# EAGLE schematic PFCEDU_V1 (EAGLE 8.6.1)
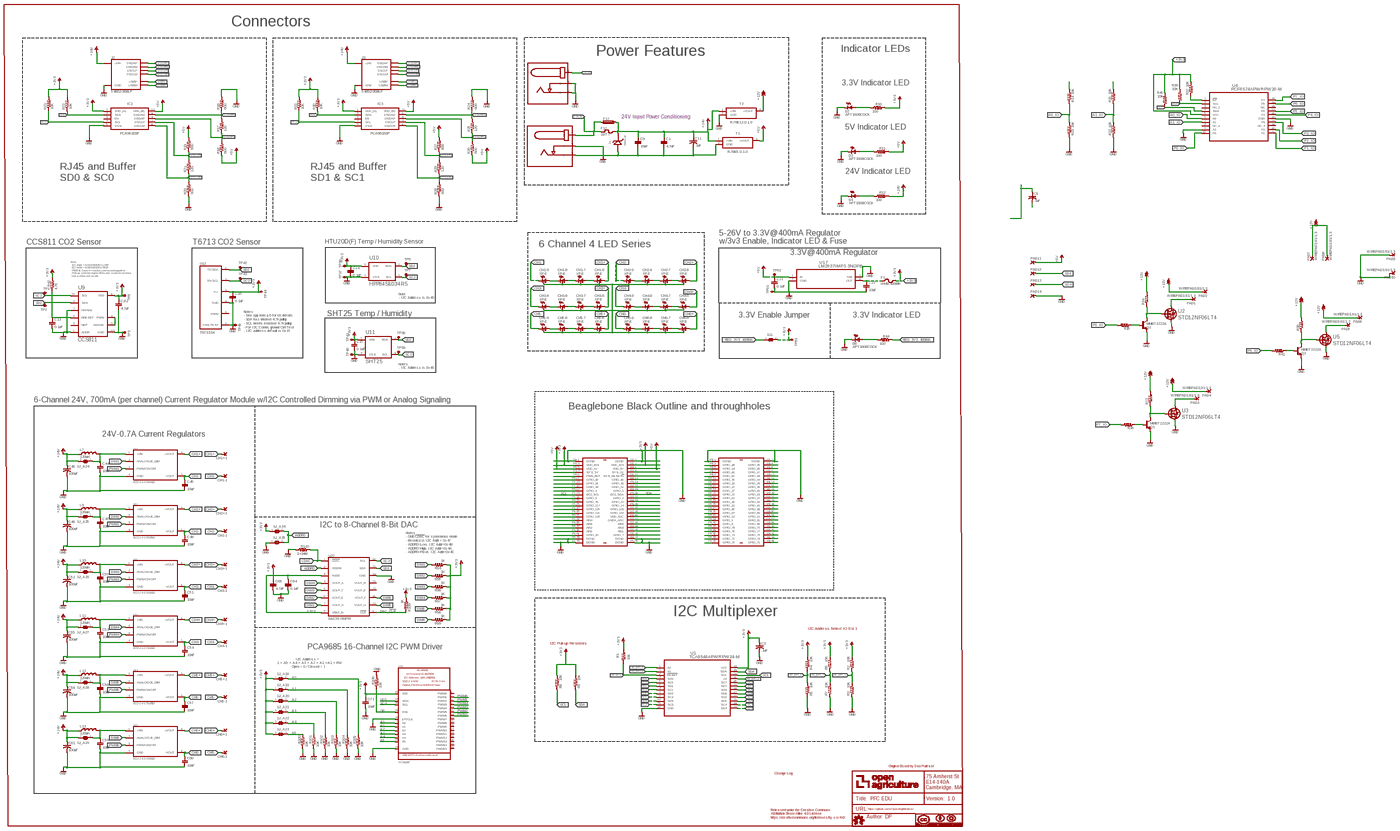
[diagram p0: schematic, sheet 1, overview]
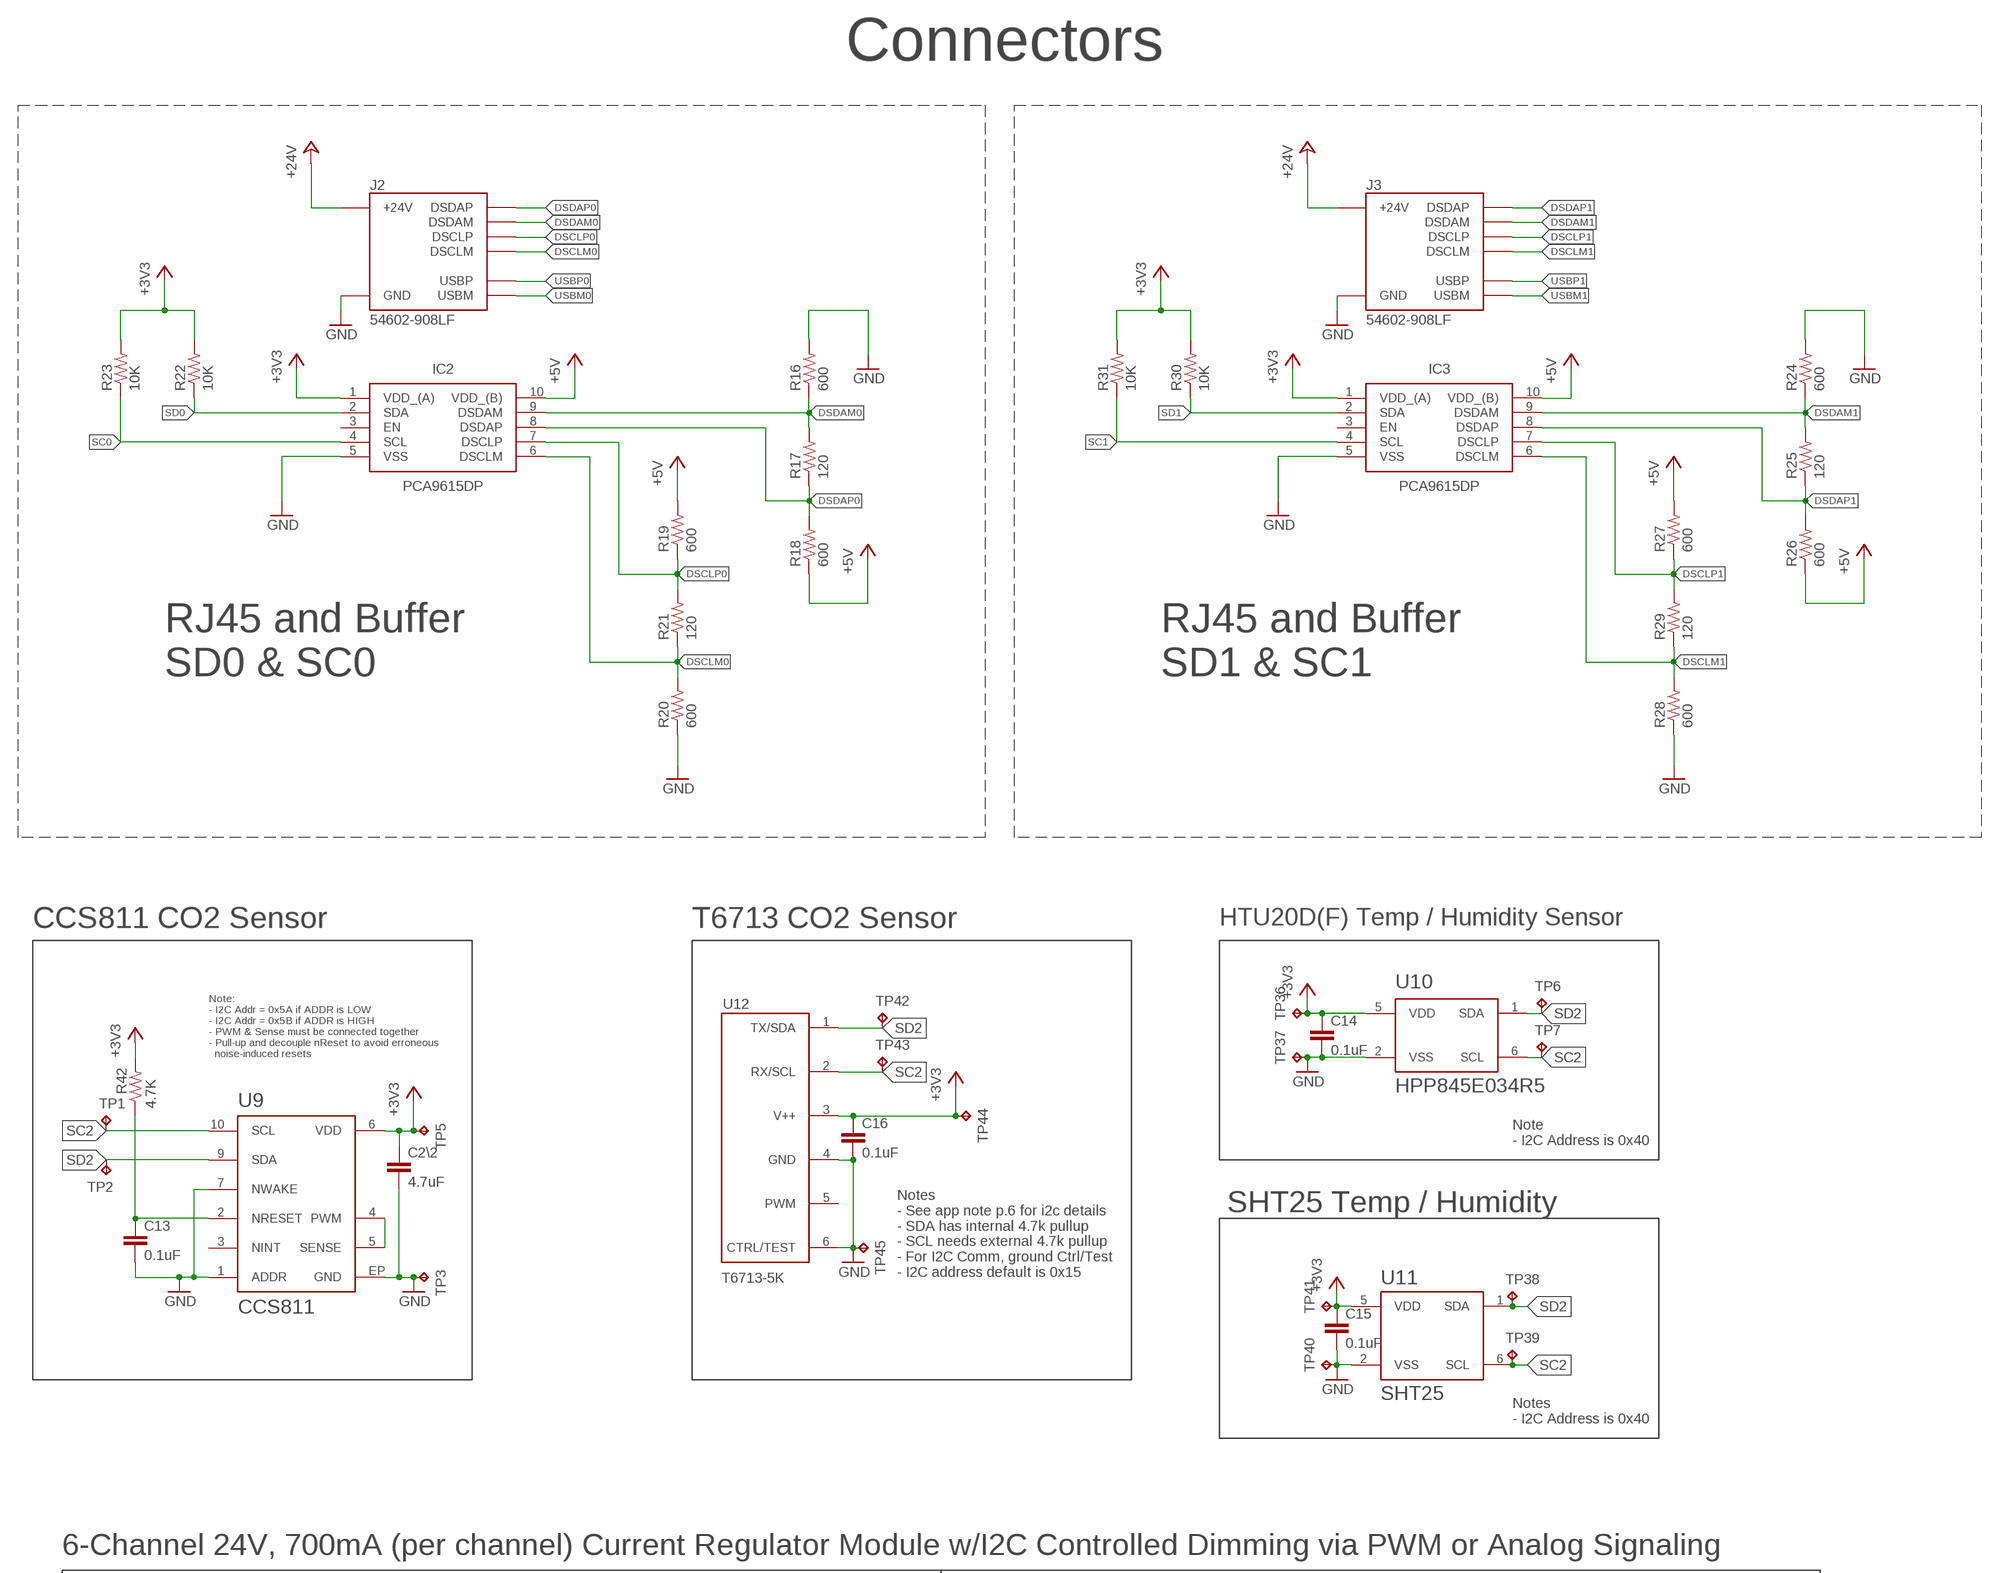
[diagram p1: schematic, sheet 1, part 1 of 5]
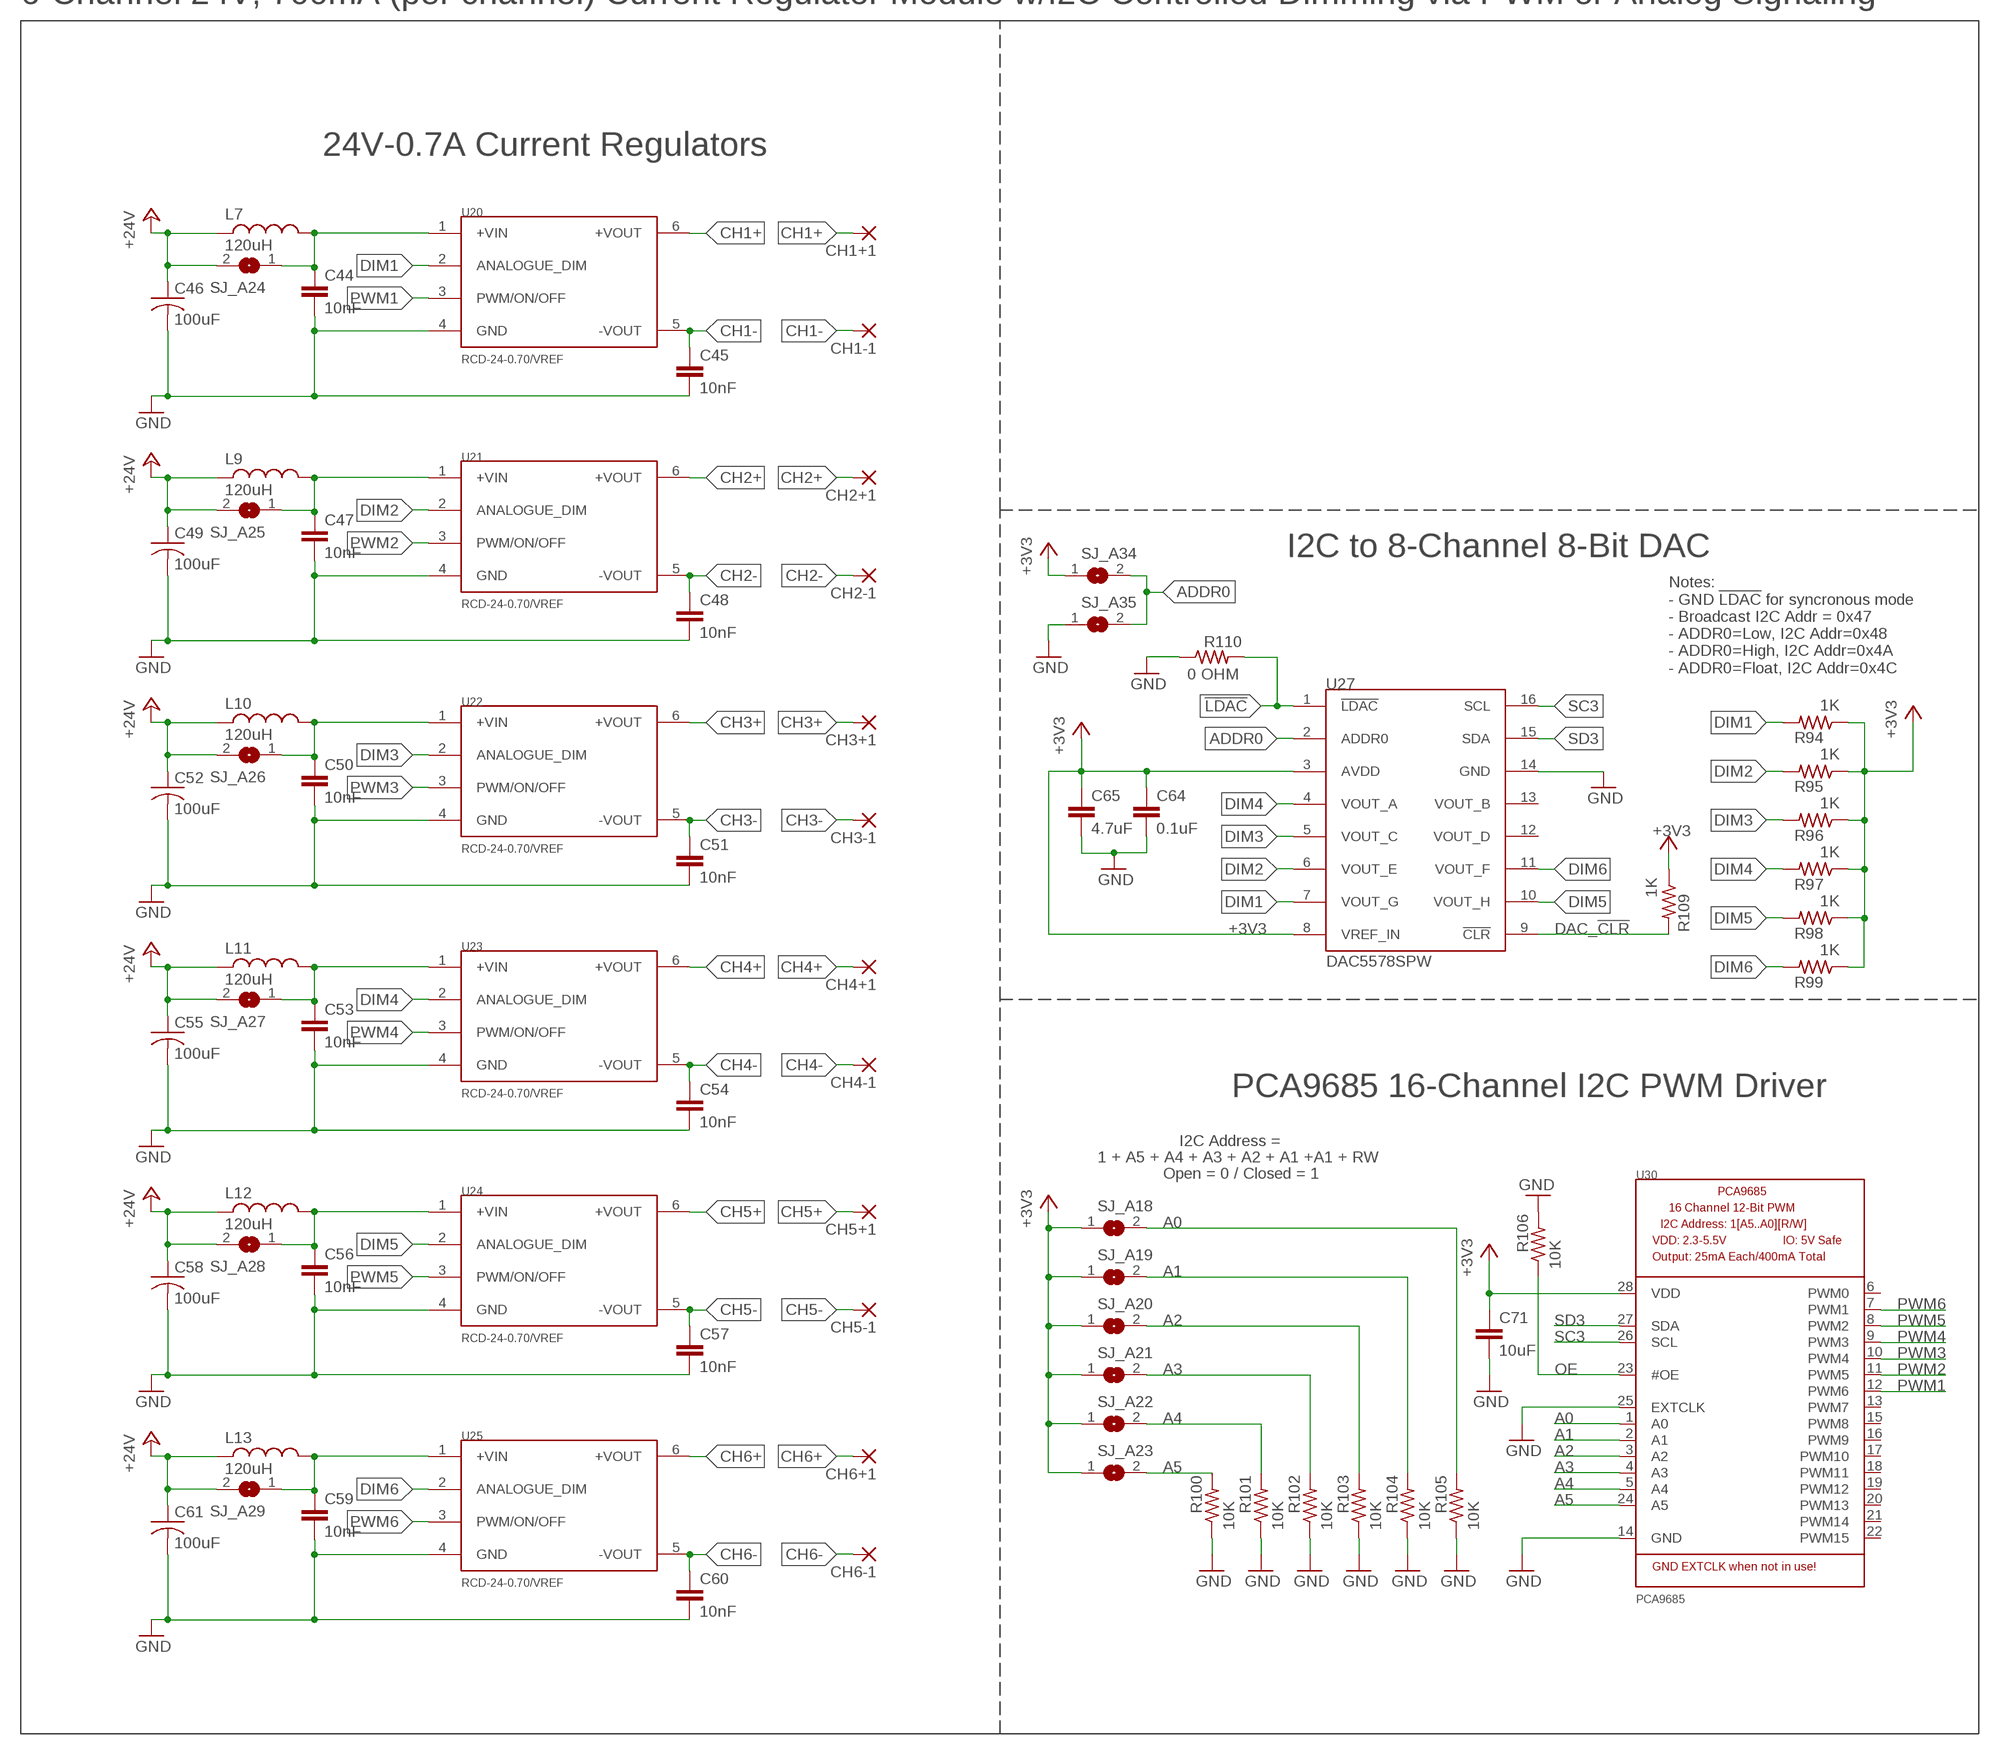
[diagram p2: schematic, sheet 1, part 2 of 5]
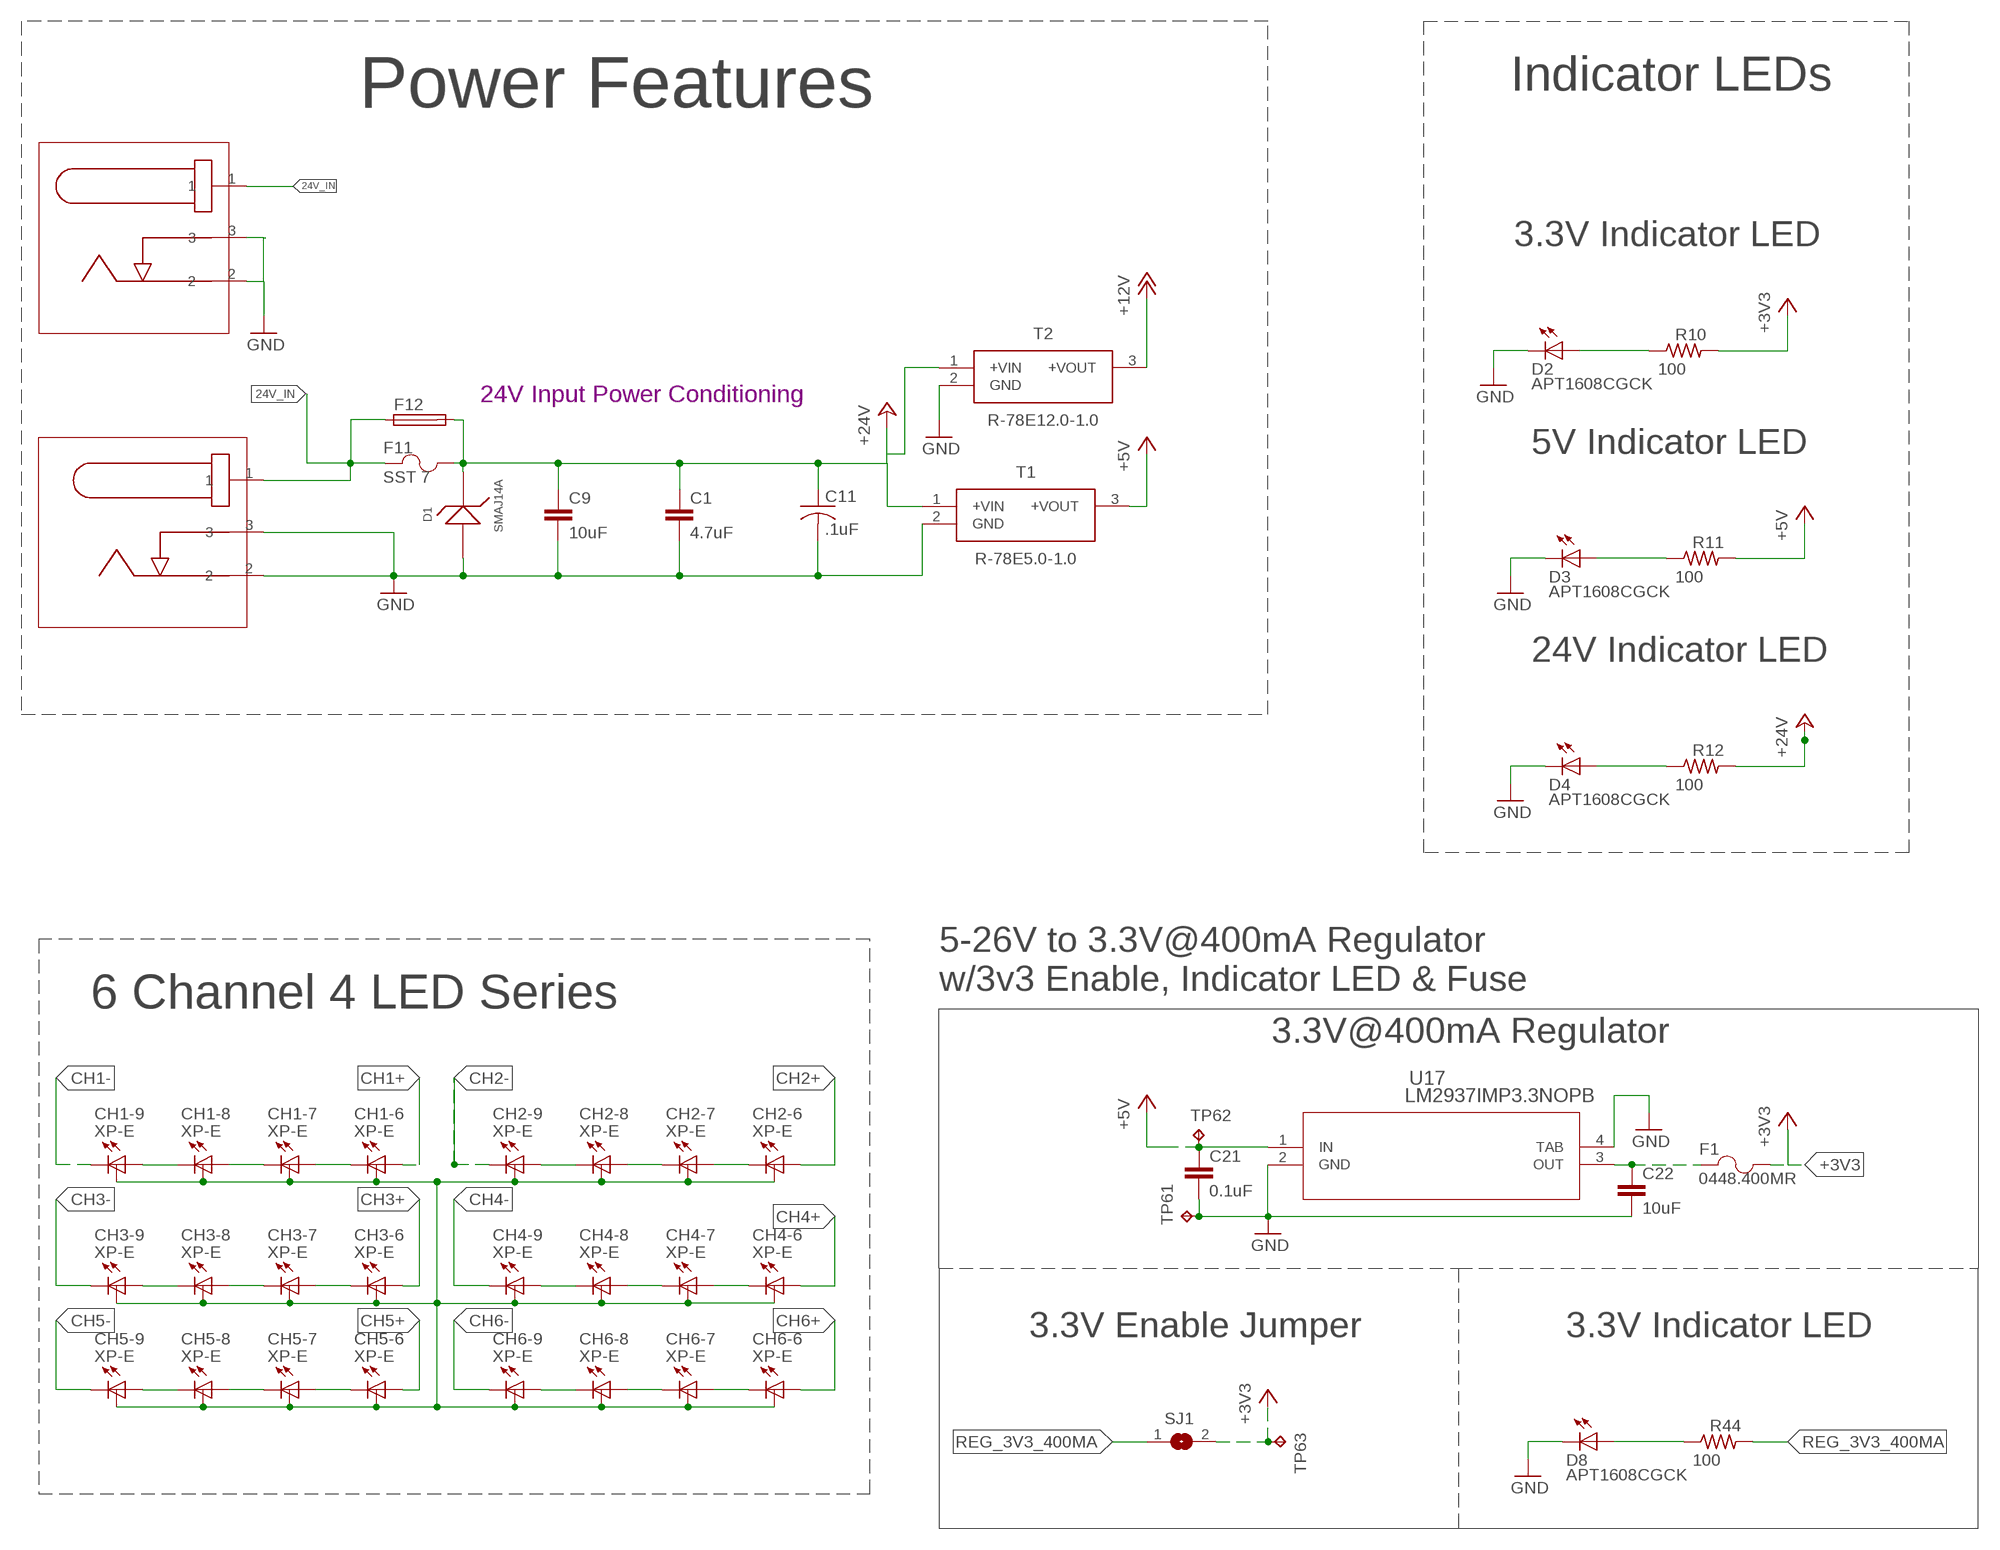
[diagram p3: schematic, sheet 1, part 3 of 5]
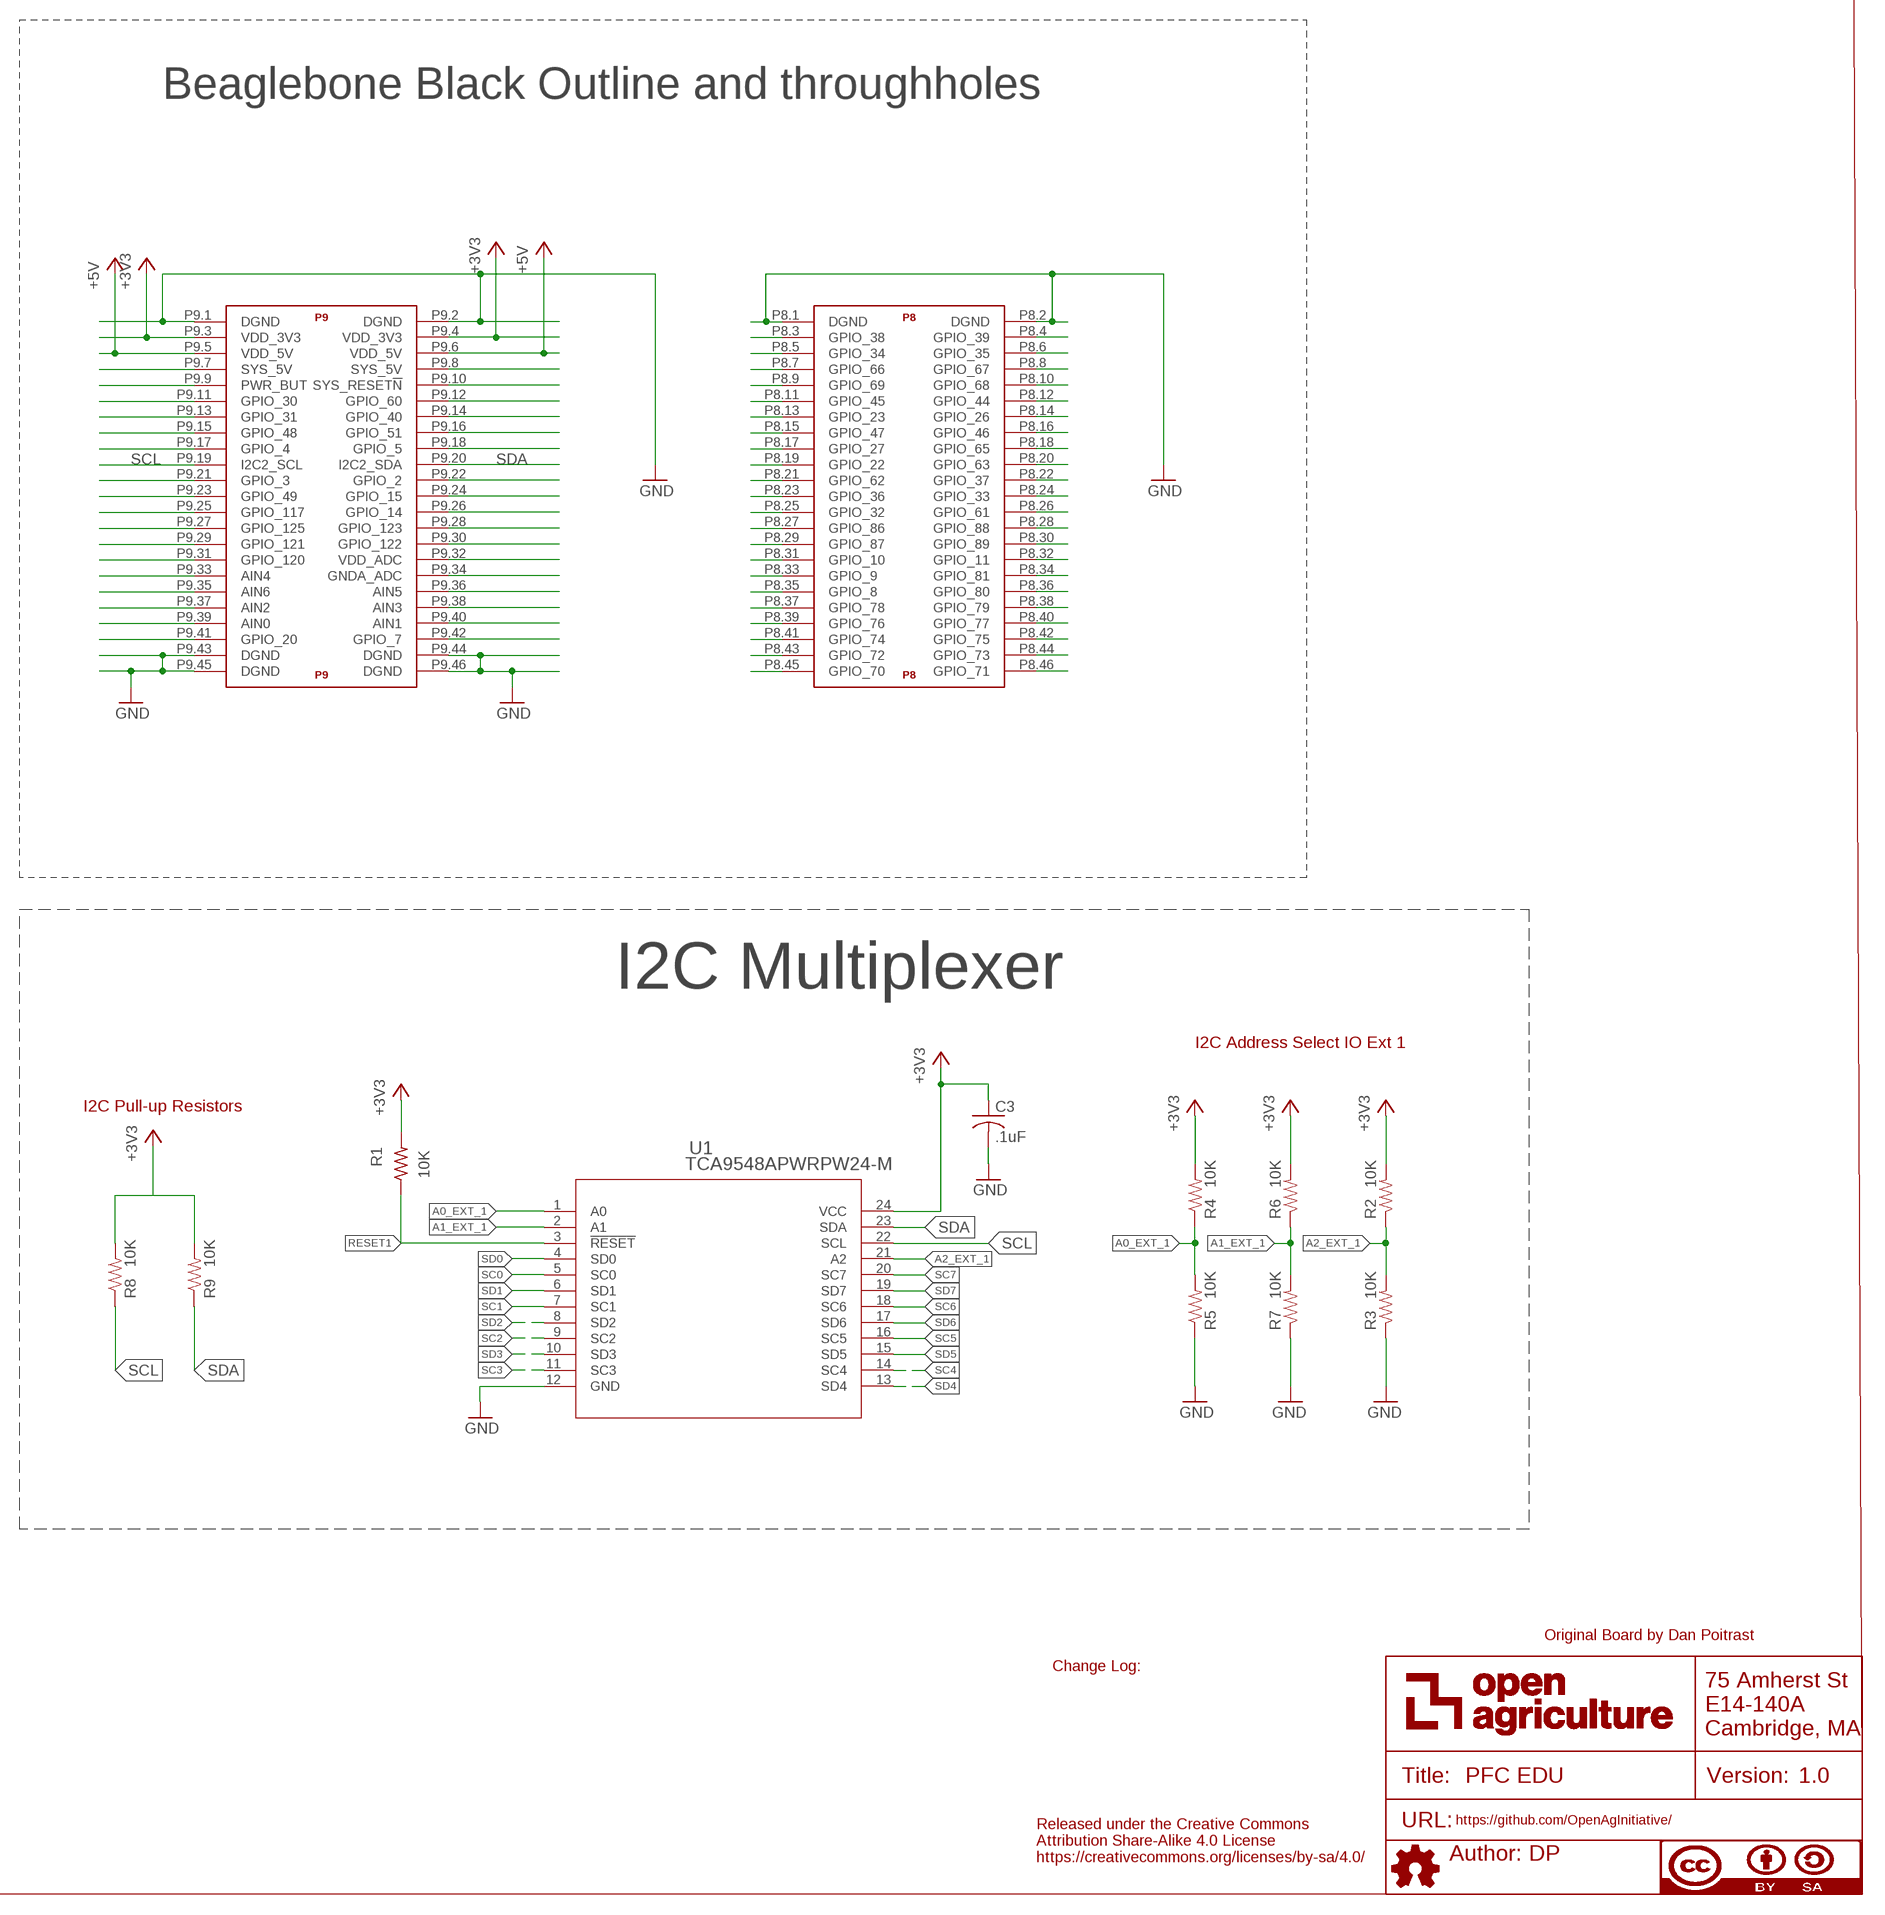
[diagram p4: schematic, sheet 1, part 4 of 5]
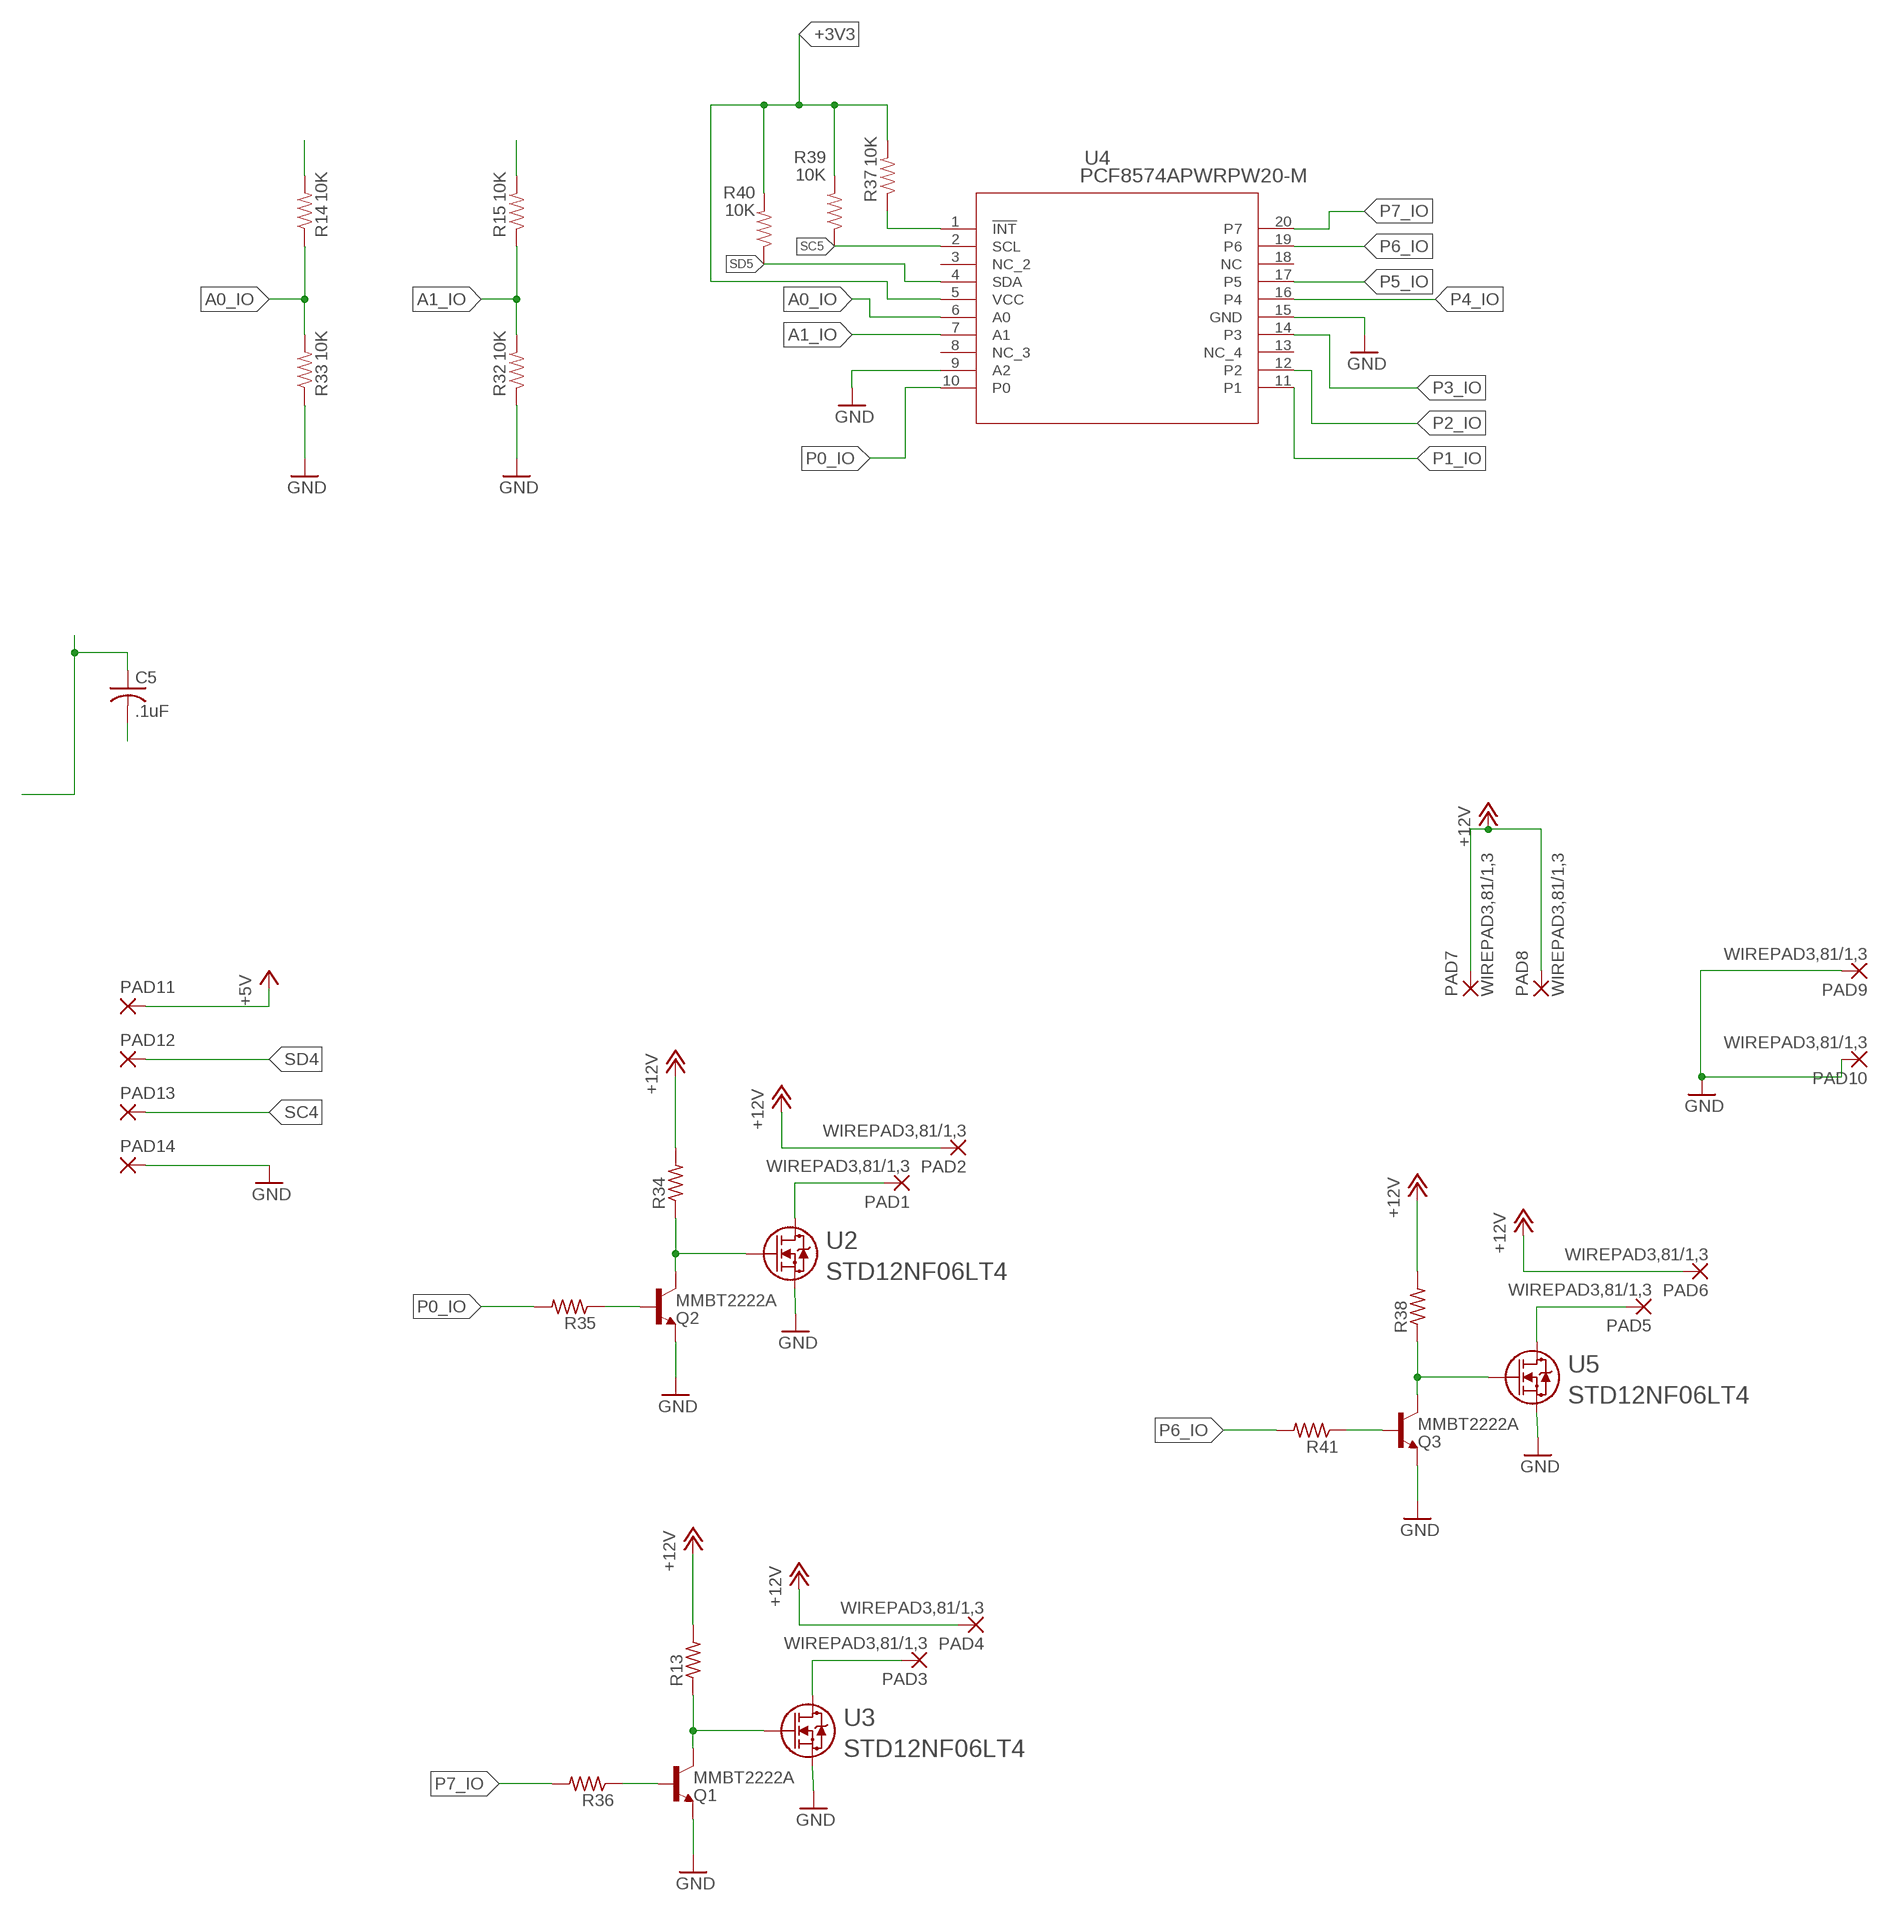
[diagram p5: schematic, sheet 1, part 5 of 5]

## Parts
ATTRIBUTES  DOCFIELD  [DOCFIELD]
C1  4.7uF  4.7UF-C1206C475K5PACTU  [CAP_C1206]
C2\2  4.7uF  4.7UF-CL21A475KBQNNNE  [C0805]
C3  .1uF  C-USC0603  [C0603@1]
C5  .1uF  C-USC0603  [C0603@1]
C9  10uF  10UF-CL31B106KBHNNNE  [C1206]
C11  .1uF  C-USC0603  [C0603@1]
C13  0.1uF  0.1UF-C0603C104K5RACTU  [C0603]
C14  0.1uF  0.1UF-C0603C104K5RACTU  [C0603]
C15  0.1uF  0.1UF-C0603C104K5RACTU  [C0603]
C16  0.1uF  0.1UF-C0603C104K5RACTU  [C0603]
C21  0.1uF  0.1UF-C0603C104K5RACTU  [C0603]
C22  10uF  10UF-GMK212BBJ106KG-T  [C0805]
C44  10nF  10NF-C0603C103K5RACTU  [C0603]
C45  10nF  10NF-C0603C103K5RACTU  [C0603]
C46  100uF  100UF-EEE-1HA101UP  [EEE-1HA101UP]
C47  10nF  10NF-C0603C103K5RACTU  [C0603]
C48  10nF  10NF-C0603C103K5RACTU  [C0603]
C49  100uF  100UF-EEE-1HA101UP  [EEE-1HA101UP]
C50  10nF  10NF-C0603C103K5RACTU  [C0603]
C51  10nF  10NF-C0603C103K5RACTU  [C0603]
C52  100uF  100UF-EEE-1HA101UP  [EEE-1HA101UP]
C53  10nF  10NF-C0603C103K5RACTU  [C0603]
C54  10nF  10NF-C0603C103K5RACTU  [C0603]
C55  100uF  100UF-EEE-1HA101UP  [EEE-1HA101UP]
C56  10nF  10NF-C0603C103K5RACTU  [C0603]
C57  10nF  10NF-C0603C103K5RACTU  [C0603]
C58  100uF  100UF-EEE-1HA101UP  [EEE-1HA101UP]
C59  10nF  10NF-C0603C103K5RACTU  [C0603]
C60  10nF  10NF-C0603C103K5RACTU  [C0603]
C61  100uF  100UF-EEE-1HA101UP  [EEE-1HA101UP]
C64  0.1uF  0.1UF-C0603C104K5RACTU  [C0603]
C65  4.7uF  4.7UF-CL21A475KBQNNNE  [C0805]
C71  10uF  10UF-GMK212BBJ106KG-T  [C0805]
CH1+1  3,17/1,3  [3,17/1,3]
CH1-1  3,17/1,3  [3,17/1,3]
CH1-6  XP-E  LED_W/THERM-XP-E  [CREE-XLAMP-XP-E]
CH1-7  XP-E  LED_W/THERM-XP-E  [CREE-XLAMP-XP-E]
CH1-8  XP-E  LED_W/THERM-XP-E  [CREE-XLAMP-XP-E]
CH1-9  XP-E  LED_W/THERM-XP-E  [CREE-XLAMP-XP-E]
CH2+1  3,17/1,3  [3,17/1,3]
CH2-1  3,17/1,3  [3,17/1,3]
CH2-6  XP-E  LED_W/THERM-XP-E  [CREE-XLAMP-XP-E]
CH2-7  XP-E  LED_W/THERM-XP-E  [CREE-XLAMP-XP-E]
CH2-8  XP-E  LED_W/THERM-XP-E  [CREE-XLAMP-XP-E]
CH2-9  XP-E  LED_W/THERM-XP-E  [CREE-XLAMP-XP-E]
CH3+1  3,17/1,3  [3,17/1,3]
CH3-1  3,17/1,3  [3,17/1,3]
CH3-6  XP-E  LED_W/THERM-XP-E  [CREE-XLAMP-XP-E]
CH3-7  XP-E  LED_W/THERM-XP-E  [CREE-XLAMP-XP-E]
CH3-8  XP-E  LED_W/THERM-XP-E  [CREE-XLAMP-XP-E]
CH3-9  XP-E  LED_W/THERM-XP-E  [CREE-XLAMP-XP-E]
CH4+1  3,17/1,3  [3,17/1,3]
CH4-1  3,17/1,3  [3,17/1,3]
CH4-6  XP-E  LED_W/THERM-XP-E  [CREE-XLAMP-XP-E]
CH4-7  XP-E  LED_W/THERM-XP-E  [CREE-XLAMP-XP-E]
CH4-8  XP-E  LED_W/THERM-XP-E  [CREE-XLAMP-XP-E]
CH4-9  XP-E  LED_W/THERM-XP-E  [CREE-XLAMP-XP-E]
CH5+1  3,17/1,3  [3,17/1,3]
CH5-1  3,17/1,3  [3,17/1,3]
CH5-6  XP-E  LED_W/THERM-XP-E  [CREE-XLAMP-XP-E]
CH5-7  XP-E  LED_W/THERM-XP-E  [CREE-XLAMP-XP-E]
CH5-8  XP-E  LED_W/THERM-XP-E  [CREE-XLAMP-XP-E]
CH5-9  XP-E  LED_W/THERM-XP-E  [CREE-XLAMP-XP-E]
CH6+1  3,17/1,3  [3,17/1,3]
CH6-1  3,17/1,3  [3,17/1,3]
CH6-6  XP-E  LED_W/THERM-XP-E  [CREE-XLAMP-XP-E]
CH6-7  XP-E  LED_W/THERM-XP-E  [CREE-XLAMP-XP-E]
CH6-8  XP-E  LED_W/THERM-XP-E  [CREE-XLAMP-XP-E]
CH6-9  XP-E  LED_W/THERM-XP-E  [CREE-XLAMP-XP-E]
D1  SMAJ14A  [DO-214AC]
D2  APT1608CGCK  [CHIPLED_0603]
D3  APT1608CGCK  [CHIPLED_0603]
D4  APT1608CGCK  [CHIPLED_0603]
D8  APT1608CGCK  [CHIPLED_0603]
F1  0448.400MR  0438.375WR  [0603]
F11  SST 7  SST_7  [SS]
F12  GSH15  [GSH15]
IC2  PCA9615DP  [SOP50P490X110-10N]
IC3  PCA9615DP  [SOP50P490X110-10N]
J2  54602-908LF  OPENAG-V1-RJ45PTH  [OPENAG-V1-RJ45]
J3  54602-908LF  OPENAG-V1-RJ45PTH  [OPENAG-V1-RJ45]
L7  120uH  120UH-74404064121  [74404064121]
L9  120uH  120UH-74404064121  [74404064121]
L10  120uH  120UH-74404064121  [74404064121]
L11  120uH  120UH-74404064121  [74404064121]
L12  120uH  120UH-74404064121  [74404064121]
L13  120uH  120UH-74404064121  [74404064121]
PAD1  WIREPAD3,81/1,3  [3,81/1,3]
PAD2  WIREPAD3,81/1,3  [3,81/1,3]
PAD3  WIREPAD3,81/1,3  [3,81/1,3]
PAD4  WIREPAD3,81/1,3  [3,81/1,3]
PAD5  WIREPAD3,81/1,3  [3,81/1,3]
PAD6  WIREPAD3,81/1,3  [3,81/1,3]
PAD7  WIREPAD3,81/1,3  [3,81/1,3]
PAD8  WIREPAD3,81/1,3  [3,81/1,3]
PAD9  WIREPAD3,81/1,3  [3,81/1,3]
PAD10  WIREPAD3,81/1,3  [3,81/1,3]
PAD11  SMD2  [SMD1,27-2,54]
PAD12  SMD2  [SMD1,27-2,54]
PAD13  SMD2  [SMD1,27-2,54]
PAD14  SMD2  [SMD1,27-2,54]
Q1  MMBT2222A  BCF30SMD  [SOT23-BEC]
Q2  MMBT2222A  BCF30SMD  [SOT23-BEC]
Q3  MMBT2222A  BCF30SMD  [SOT23-BEC]
R1  10K  R-US_R0603  [R0603]
R2  10K  10KOHM-1/10W-1%(0603)0603  [0603-RES]
R3  10K  10KOHM-1/10W-1%(0603)0603  [0603-RES]
R4  10K  10KOHM-1/10W-1%(0603)0603  [0603-RES]
R5  10K  10KOHM-1/10W-1%(0603)0603  [0603-RES]
R6  10K  10KOHM-1/10W-1%(0603)0603  [0603-RES]
R7  10K  10KOHM-1/10W-1%(0603)0603  [0603-RES]
R8  10K  10KOHM-1/10W-1%(0603)0603  [0603-RES]
R9  10K  10KOHM-1/10W-1%(0603)0603  [0603-RES]
R10  100  100OHM-RC0603JR-07100RL  [RC0603N]
R11  100  100OHM-RC0603JR-07100RL  [RC0603N]
R12  100  100OHM-RC0603JR-07100RL  [RC0603N]
R13  R-US_R0805W  [R0805W]
R14  10K  10KOHM-1/10W-1%(0603)0603  [0603-RES]
R15  10K  10KOHM-1/10W-1%(0603)0603  [0603-RES]
R16  600  R-US_R0603  [R0603]
R17  120  R-US_R0603  [R0603]
R18  600  R-US_R0603  [R0603]
R19  600  R-US_R0603  [R0603]
R20  600  R-US_R0603  [R0603]
R21  120  R-US_R0603  [R0603]
R22  10K  R-US_R0603  [R0603]
R23  10K  R-US_R0603  [R0603]
R24  600  R-US_R0603  [R0603]
R25  120  R-US_R0603  [R0603]
R26  600  R-US_R0603  [R0603]
R27  600  R-US_R0603  [R0603]
R28  600  R-US_R0603  [R0603]
R29  120  R-US_R0603  [R0603]
R30  10K  R-US_R0603  [R0603]
R31  10K  R-US_R0603  [R0603]
R32  10K  10KOHM-1/10W-1%(0603)0603  [0603-RES]
R33  10K  10KOHM-1/10W-1%(0603)0603  [0603-RES]
R34  R-US_R0805W  [R0805W]
R35  R-US_R0805W  [R0805W]
R36  R-US_R0805W  [R0805W]
R37  10K  10KOHM-1/10W-1%(0603)0603  [0603-RES]
R38  R-US_R0805W  [R0805W]
R39  10K  10KOHM-1/10W-1%(0603)0603  [0603-RES]
R40  10K  10KOHM-1/10W-1%(0603)0603  [0603-RES]
R41  R-US_R0805W  [R0805W]
R42  4.7K  4.7K-RC1206JR-074K7L  [R1206]
R44  100  100OHM-RC0603JR-07100RL  [RC0603N]
R94  1K  1K-ERJ-PB3D1001V  [RC0603N]
R95  1K  1K-ERJ-PB3D1001V  [RC0603N]
R96  1K  1K-ERJ-PB3D1001V  [RC0603N]
R97  1K  1K-ERJ-PB3D1001V  [RC0603N]
R98  1K  1K-ERJ-PB3D1001V  [RC0603N]
R99  1K  1K-ERJ-PB3D1001V  [RC0603N]
R100  10K  10K-ERJ-3EKF1002V  [RC0603N]
R101  10K  10K-ERJ-3EKF1002V  [RC0603N]
R102  10K  10K-ERJ-3EKF1002V  [RC0603N]
R103  10K  10K-ERJ-3EKF1002V  [RC0603N]
R104  10K  10K-ERJ-3EKF1002V  [RC0603N]
R105  10K  10K-ERJ-3EKF1002V  [RC0603N]
R106  10K  10K-ERJ-3EKF1002V  [RC0603N]
R109  1K  1K-ERJ-PB3D1001V  [RC0603N]
R110  0 OHM  0OHM-RC0603JR-070RL  [RC0603N]
SJ1  SOLDERJUMPERREFLOW_NOPASTE  [SOLDERJUMPER_REFLOW_NOPASTE]
SJ_A18  SOLDERJUMPERREFLOW_NOPASTE  [SOLDERJUMPER_REFLOW_NOPASTE]
SJ_A19  SOLDERJUMPERREFLOW_NOPASTE  [SOLDERJUMPER_REFLOW_NOPASTE]
SJ_A20  SOLDERJUMPERREFLOW_NOPASTE  [SOLDERJUMPER_REFLOW_NOPASTE]
SJ_A21  SOLDERJUMPERREFLOW_NOPASTE  [SOLDERJUMPER_REFLOW_NOPASTE]
SJ_A22  SOLDERJUMPERREFLOW_NOPASTE  [SOLDERJUMPER_REFLOW_NOPASTE]
SJ_A23  SOLDERJUMPERREFLOW_NOPASTE  [SOLDERJUMPER_REFLOW_NOPASTE]
SJ_A24  SOLDERJUMPERREFLOW_NOPASTE  [SOLDERJUMPER_REFLOW_NOPASTE]
SJ_A25  SOLDERJUMPERREFLOW_NOPASTE  [SOLDERJUMPER_REFLOW_NOPASTE]
SJ_A26  SOLDERJUMPERREFLOW_NOPASTE  [SOLDERJUMPER_REFLOW_NOPASTE]
SJ_A27  SOLDERJUMPERREFLOW_NOPASTE  [SOLDERJUMPER_REFLOW_NOPASTE]
SJ_A28  SOLDERJUMPERREFLOW_NOPASTE  [SOLDERJUMPER_REFLOW_NOPASTE]
SJ_A29  SOLDERJUMPERREFLOW_NOPASTE  [SOLDERJUMPER_REFLOW_NOPASTE]
SJ_A34  SOLDERJUMPERREFLOW_NOPASTE  [SOLDERJUMPER_REFLOW_NOPASTE]
SJ_A35  SOLDERJUMPERREFLOW_NOPASTE  [SOLDERJUMPER_REFLOW_NOPASTE]
T1  R-78E5.0-1.0  [R-78E5.0-1.0]
T2  R-78E12.0-1.0  R-78E5.0-1.0  [R-78E5.0-1.0]
TP1  TPTP06R  [TP06R]
TP2  TPTP06R  [TP06R]
TP3  TPTP06R  [TP06R]
TP5  TPTP06R  [TP06R]
TP6  TPTP06R  [TP06R]
TP7  TPTP06R  [TP06R]
TP36  TPTP06R  [TP06R]
TP37  TPTP06R  [TP06R]
TP38  TPTP06R  [TP06R]
TP39  TPTP06R  [TP06R]
TP40  TPTP06R  [TP06R]
TP41  TPTP06R  [TP06R]
TP42  TPTP06R  [TP06R]
TP43  TPTP06R  [TP06R]
TP44  TPTP06R  [TP06R]
TP45  TPTP06R  [TP06R]
TP61  TPTP06R  [TP06R]
TP62  TPTP06R  [TP06R]
TP63  TPTP06R  [TP06R]
U1  TCA9548APWRPW24-M  [PW24-M]
U2  STD12NF06LT4  [DPAK]
U3  STD12NF06LT4  [DPAK]
U4  PCF8574APWRPW20-M  [PW20-M]
U5  STD12NF06LT4  [DPAK]
U9  CCS811  [CCS811]
U10  HPP845E034R5  [HTU20D(F)]
U11  SHT25  [SHT2X]
U12  T6713-5K  [T6713]
U17  LM2937IMP3.3NOPB  LM2937IMP-3.3/NOPB  [MP04A]
U20  RCD-24-0.70/VREF  [RCD-24-PINNED]
U21  RCD-24-0.70/VREF  [RCD-24-PINNED]
U22  RCD-24-0.70/VREF  [RCD-24-PINNED]
U23  RCD-24-0.70/VREF  [RCD-24-PINNED]
U24  RCD-24-0.70/VREF  [RCD-24-PINNED]
U25  RCD-24-0.70/VREF  [RCD-24-PINNED]
U27  DAC5578SPW  [TSSOP16]
U30  PCA9685  PCA9685PW/Q900,118  [TSSOP28]
U$1  PJ-036AH  [PJ-036AH]
U$2  BEAGLE_BONE_BLACK_CAPE  [BEAGLE_BONE_BLACK_CAPE]
U$3  PJ-036AH  [PJ-036AH]

## Nets
24V_IN: F11.1 F12.1 U$1.1 U$3.1
!LDAC!: R110.2 U27.1(!LDAC!)
+3V3: C2\2.1 C3.1 C5.1 C14.1 C15.1 C16.1 C64.1 C65.1 C71.1 F1.2 IC2.1(VDD_(A)) IC3.1(VDD_(A)) R1.2 R2.2 R4.2 R6.2 R8.2 R9.2 R10.2 R14.2 R15.2 R22.2 R23.2 R30.2 R31.2 R37.2 R39.2 R40.2 R42.2 R94.1 R95.1 R96.1 R97.1 R98.1 R99.1 R109.1 SJ1.2 SJ_A18.1 SJ_A19.1 SJ_A20.1 SJ_A21.1 SJ_A22.1 SJ_A23.1 SJ_A34.1 TP5.TP TP36.TP TP41.TP TP44.TP TP63.TP U1.24(VCC) U4.5(VCC) U9.6(VDD) U10.5(VDD) U11.5(VDD) U12.3(V++) U27.3(AVDD) U27.8(VREF_IN) U30.28(VDD) U$2.P9.3(P9:VDD_3V3) U$2.P9.4(P9:VDD_3V3)
+5V: C21.1 IC2.10(VDD_(B)) IC3.10(VDD_(B)) PAD11.1(P) R11.2 R18.1 R19.2 R26.1 R27.2 T1.3(+VOUT) TP62.TP U17.1(IN) U$2.P9.5(P9:VDD_5V) U$2.P9.6(P9:VDD_5V)
+12V: PAD2.1(P) PAD4.1(P) PAD6.1(P) PAD7.1(P) PAD8.1(P) R13.2 R34.2 R38.2 T2.3(+VOUT)
+24V: C1.1 C9.1 C11.1 C46.+(1(+)) C49.+(1(+)) C52.+(1(+)) C55.+(1(+)) C58.+(1(+)) C61.+(1(+)) D1.C F11.2 F12.2 J2.24V(6)(+24V) J3.24V(6)(+24V) L7.1 L9.1 L10.1 L11.1 L12.1 L13.1 R12.2 SJ_A24.2 SJ_A25.2 SJ_A26.2 SJ_A27.2 SJ_A28.2 SJ_A29.2 T1.1(+VIN) T2.1(+VIN)
A0: R105.2 SJ_A18.2 U30.1(A0)
A0_EXT_1: R4.1 R5.2 U1.1(A0)
A0_IO: R14.1 R33.2 U4.6(A0)
A1: R104.2 SJ_A19.2 U30.2(A1)
A1_EXT_1: R6.1 R7.2 U1.2(A1)
A1_IO: R15.1 R32.2 U4.7(A1)
A2: R103.2 SJ_A20.2 U30.3(A2)
A2_EXT_1: R2.1 R3.2 U1.21(A2)
A3: R102.2 SJ_A21.2 U30.4(A3)
A4: R101.2 SJ_A22.2 U30.5(A4)
A5: R100.2 SJ_A23.2 U30.24(A5)
ADDR0: SJ_A34.2 SJ_A35.2 U27.2(ADDR0)
CH1+: CH1+1.1(P) CH1-6.A CH1-6.A@1(A) U20.6(+VOUT)
CH1-: C45.1 CH1-1.1(P) CH1-9.C CH1-9.C@1(C) U20.5(-VOUT)
CH2+: CH2+1.1(P) CH2-6.A CH2-6.A@1(A) U21.6(+VOUT)
CH2-: C48.1 CH2-1.1(P) CH2-9.C CH2-9.C@1(C) U21.5(-VOUT)
CH3+: CH3+1.1(P) CH3-6.A CH3-6.A@1(A) U22.6(+VOUT)
CH3-: C51.1 CH3-1.1(P) CH3-9.C CH3-9.C@1(C) U22.5(-VOUT)
CH4+: CH4+1.1(P) CH4-6.A CH4-6.A@1(A) U23.6(+VOUT)
CH4-: C54.1 CH4-1.1(P) CH4-9.C CH4-9.C@1(C) U23.5(-VOUT)
CH5+: CH5+1.1(P) CH5-6.A CH5-6.A@1(A) U24.6(+VOUT)
CH5-: C57.1 CH5-1.1(P) CH5-9.C CH5-9.C@1(C) U24.5(-VOUT)
CH6+: CH6+1.1(P) CH6-6.A CH6-6.A@1(A) U25.6(+VOUT)
CH6-: C60.1 CH6-1.1(P) CH6-9.C CH6-9.C@1(C) U25.5(-VOUT)
DAC_!CLR!: R109.2 U27.9(!CLR!)
DIM1: R94.2 U20.2(ANALOGUE_DIM) U27.7(VOUT_G)
DIM2: R95.2 U21.2(ANALOGUE_DIM) U27.6(VOUT_E)
DIM3: R96.2 U22.2(ANALOGUE_DIM) U27.5(VOUT_C)
DIM4: R97.2 U23.2(ANALOGUE_DIM) U27.4(VOUT_A)
DIM5: R98.2 U24.2(ANALOGUE_DIM) U27.10(VOUT_H)
DIM6: R99.2 U25.2(ANALOGUE_DIM) U27.11(VOUT_F)
DSCLM0: IC2.6(DSCLM) J2.DSCLM(5)(DSCLM) R20.2 R21.1
DSCLM1: IC3.6(DSCLM) J3.DSCLM(5)(DSCLM) R28.2 R29.1
DSCLP0: IC2.7(DSCLP) J2.DSCLP(4)(DSCLP) R19.1 R21.2
DSCLP1: IC3.7(DSCLP) J3.DSCLP(4)(DSCLP) R27.1 R29.2
DSDAM0: IC2.9(DSDAM) J2.DSDAM(2)(DSDAM) R16.1 R17.2
DSDAM1: IC3.9(DSDAM) J3.DSDAM(2)(DSDAM) R24.1 R25.2
DSDAP0: IC2.8(DSDAP) J2.DSDAP(1)(DSDAP) R17.1 R18.2
DSDAP1: IC3.8(DSDAP) J3.DSDAP(1)(DSDAP) R25.1 R26.2
GND: C1.2 C2\2.2 C3.2 C5.2 C9.2 C11.2 C13.2 C14.2 C15.2 C16.2 C21.2 C22.2 C44.2 C45.2 C46.-(2(-)) C47.2 C48.2 C49.-(2(-)) C50.2 C51.2 C52.-(2(-)) C53.2 C54.2 C55.-(2(-)) C56.2 C57.2 C58.-(2(-)) C59.2 C60.2 C61.-(2(-)) C64.2 C65.2 C71.2 D1.A D2.C D3.C D4.C D8.C IC2.5(VSS) IC3.5(VSS) J2.GND(3)(GND) J3.GND(3)(GND) PAD9.1(P) PAD10.1(P) PAD14.1(P) Q1.E Q2.E Q3.E R3.1 R5.1 R7.1 R16.2 R20.1 R24.2 R28.1 R32.1 R33.1 R100.1 R101.1 R102.1 R103.1 R104.1 R105.1 R106.2 R110.1 SJ_A35.1 T1.2(GND) T2.2(GND) TP3.TP TP37.TP TP40.TP TP45.TP TP61.TP U1.12(GND) U2.2 U3.2 U4.9(A2) U4.15(GND) U5.2 U9.1(ADDR) U9.7(NWAKE) U9.EP(GND) U10.2(VSS) U11.2(VSS) U12.4(GND) U12.6(CTRL/TEST) U17.2(GND) U17.4(TAB) U20.4(GND) U21.4(GND) U22.4(GND) U23.4(GND) U24.4(GND) U25.4(GND) U27.14(GND) U30.14(GND) U30.25(EXTCLK) U$1.2 U$1.3 U$2.P8.1(P8:DGND) U$2.P8.2(P8:DGND) U$2.P9.1(P9:DGND) U$2.P9.2(P9:DGND) U$2.P9.43(P9:DGND) U$2.P9.44(P9:DGND) U$2.P9.45(P9:DGND) U$2.P9.46(P9:DGND) U$3.2 U$3.3
MOS1: PAD3.1(P) U3.3
MOS2: PAD1.1(P) U2.3
MOS3: PAD5.1(P) U5.3
N$1: U$2.P8.45(P8:GPIO_70)
N$2: D3.A R11.1
N$3: U$2.P8.43(P8:GPIO_72)
N$4: D4.A R12.1
N$5: Q1.C R13.1 U3.1
N$6: U$2.P8.41(P8:GPIO_74)
N$7: U$2.P8.39(P8:GPIO_76)
N$8: U$2.P8.37(P8:GPIO_78)
N$9: Q1.B R36.1
N$10: U$2.P8.35(P8:GPIO_8)
N$11: U$2.P8.33(P8:GPIO_9)
N$12: D2.A R10.1
N$13: R37.1 U4.1(!INT)
N$14: Q2.C R34.1 U2.1
N$15: Q2.B R35.1
N$16: Q3.C R38.1 U5.1
N$17: Q3.B R41.1
N$29: CH2-8.C CH2-8.C@1(C) CH2-9.A CH2-9.A@1(A)
N$30: U$2.P8.31(P8:GPIO_10)
N$31: CH2-7.C CH2-7.C@1(C) CH2-8.A CH2-8.A@1(A)
N$32: CH2-6.C CH2-6.C@1(C) CH2-7.A CH2-7.A@1(A)
N$33: CH4-8.C CH4-8.C@1(C) CH4-9.A CH4-9.A@1(A)
N$34: CH4-7.C CH4-7.C@1(C) CH4-8.A CH4-8.A@1(A)
N$35: CH4-6.C CH4-6.C@1(C) CH4-7.A CH4-7.A@1(A)
N$36: CH6-8.C CH6-8.C@1(C) CH6-9.A CH6-9.A@1(A)
N$37: CH6-7.C CH6-7.C@1(C) CH6-8.A CH6-8.A@1(A)
N$38: C44.1 L7.2 SJ_A24.1 U20.1(+VIN)
N$39: C47.1 L9.2 SJ_A25.1 U21.1(+VIN)
N$40: C50.1 L10.2 SJ_A26.1 U22.1(+VIN)
N$41: C53.1 L11.2 SJ_A27.1 U23.1(+VIN)
N$42: U9.4(PWM) U9.5(SENSE)
N$43: C13.1 R42.1 U9.2(NRESET)
N$44: C56.1 L12.2 SJ_A28.1 U24.1(+VIN)
N$45: C59.1 L13.2 SJ_A29.1 U25.1(+VIN)
N$46: CH6-6.C CH6-6.C@1(C) CH6-7.A CH6-7.A@1(A)
N$47: CH1-8.C CH1-8.C@1(C) CH1-9.A CH1-9.A@1(A)
N$48: CH1-7.C CH1-7.C@1(C) CH1-8.A CH1-8.A@1(A)
N$53: U$2.P8.29(P8:GPIO_87)
N$54: U$2.P8.27(P8:GPIO_86)
N$55: U$2.P8.25(P8:GPIO_32)
N$67: U$2.P8.23(P8:GPIO_36)
N$74: U$2.P8.21(P8:GPIO_62)
N$75: U$2.P8.19(P8:GPIO_22)
N$76: U$2.P8.17(P8:GPIO_27)
N$77: U$2.P8.15(P8:GPIO_47)
N$78: U$2.P8.13(P8:GPIO_23)
N$81: CH1-6.C CH1-6.C@1(C) CH1-7.A CH1-7.A@1(A)
N$82: CH3-8.C CH3-8.C@1(C) CH3-9.A CH3-9.A@1(A)
N$83: CH3-7.C CH3-7.C@1(C) CH3-8.A CH3-8.A@1(A)
N$84: CH3-6.C CH3-6.C@1(C) CH3-7.A CH3-7.A@1(A)
N$85: CH5-8.C CH5-8.C@1(C) CH5-9.A CH5-9.A@1(A)
N$90: U$2.P8.11(P8:GPIO_45)
N$97: U$2.P8.9(P8:GPIO_69)
N$98: U$2.P8.7(P8:GPIO_66)
N$99: U$2.P8.5(P8:GPIO_34)
N$100: U$2.P8.3(P8:GPIO_38)
N$101: U$2.P8.46(P8:GPIO_71)
N$102: U$2.P8.44(P8:GPIO_73)
N$103: U$2.P8.42(P8:GPIO_75)
N$104: U$2.P8.40(P8:GPIO_77)
N$105: U$2.P8.38(P8:GPIO_79)
N$106: U$2.P8.36(P8:GPIO_80)
N$107: U$2.P8.34(P8:GPIO_81)
N$108: U$2.P8.32(P8:GPIO_11)
N$109: U$2.P8.30(P8:GPIO_89)
N$110: U$2.P8.28(P8:GPIO_88)
N$111: U$2.P8.26(P8:GPIO_61)
N$112: U$2.P8.24(P8:GPIO_33)
N$113: U$2.P8.22(P8:GPIO_37)
N$114: U$2.P8.20(P8:GPIO_63)
N$115: U$2.P8.18(P8:GPIO_65)
N$116: U$2.P8.16(P8:GPIO_46)
N$117: U$2.P8.14(P8:GPIO_26)
N$118: U$2.P8.12(P8:GPIO_44)
N$119: U$2.P8.10(P8:GPIO_68)
N$120: U$2.P8.8(P8:GPIO_67)
N$121: U$2.P8.6(P8:GPIO_35)
N$122: U$2.P8.4(P8:GPIO_39)
N$123: U$2.P9.42(P9:GPIO_7)
N$124: U$2.P9.40(P9:AIN1)
N$125: U$2.P9.38(P9:AIN3)
N$126: U$2.P9.36(P9:AIN5)
N$127: U$2.P9.34(P9:GNDA_ADC)
N$128: U$2.P9.32(P9:VDD_ADC)
N$129: U$2.P9.30(P9:GPIO_122)
N$130: U$2.P9.28(P9:GPIO_123)
N$131: U$2.P9.26(P9:GPIO_14)
N$132: U$2.P9.24(P9:GPIO_15)
N$133: U$2.P9.22(P9:GPIO_2)
N$134: U$2.P9.18(P9:GPIO_5)
N$135: U$2.P9.16(P9:GPIO_51)
N$136: U$2.P9.14(P9:GPIO_40)
N$137: U$2.P9.12(P9:GPIO_60)
N$138: U$2.P9.10(P9:SYS_RESET!N)
N$139: U$2.P9.8(P9:SYS_5V)
N$140: U$2.P9.41(P9:GPIO_20)
N$141: U$2.P9.39(P9:AIN0)
N$142: U$2.P9.37(P9:AIN2)
N$143: U$2.P9.35(P9:AIN6)
N$144: U$2.P9.33(P9:AIN4)
N$145: U$2.P9.31(P9:GPIO_120)
N$146: U$2.P9.29(P9:GPIO_121)
N$147: U$2.P9.27(P9:GPIO_125)
N$148: U$2.P9.25(P9:GPIO_117)
N$149: U$2.P9.23(P9:GPIO_49)
N$150: U$2.P9.21(P9:GPIO_3)
N$151: U$2.P9.17(P9:GPIO_4)
N$152: U$2.P9.15(P9:GPIO_48)
N$153: U$2.P9.13(P9:GPIO_31)
N$154: U$2.P9.11(P9:GPIO_30)
N$155: U$2.P9.9(P9:PWR_BUT)
N$156: U$2.P9.7(P9:SYS_5V)
N$159: CH5-7.C CH5-7.C@1(C) CH5-8.A CH5-8.A@1(A)
N$160: CH5-6.C CH5-6.C@1(C) CH5-7.A CH5-7.A@1(A)
N$179: D8.A R44.1
N$180: C22.1 F1.1 U17.3(OUT)
OE: R106.1 U30.23(#OE)
P0_IO: R35.2 U4.10(P0)
P1_IO: U4.11(P1)
P2_IO: U4.12(P2)
P3_IO: U4.14(P3)
P4_IO: U4.16(P4)
P5_IO: U4.17(P5)
P6_IO: R41.2 U4.19(P6)
P7_IO: R36.2 U4.20(P7)
PWM1: U20.3(PWM/ON/OFF) U30.12(PWM6)
PWM2: U21.3(PWM/ON/OFF) U30.11(PWM5)
PWM3: U22.3(PWM/ON/OFF) U30.10(PWM4)
PWM4: U23.3(PWM/ON/OFF) U30.9(PWM3)
PWM5: U24.3(PWM/ON/OFF) U30.8(PWM2)
PWM6: U25.3(PWM/ON/OFF) U30.7(PWM1)
REG_3V3_400MA: R44.2 SJ1.1
RESET1: R1.1 U1.3(!RESET)
SC0: IC2.4(SCL) R23.1 U1.5(SC0)
SC1: IC3.4(SCL) R31.1 U1.7(SC1)
SC2: TP1.TP TP7.TP TP39.TP TP43.TP U1.9(SC2) U9.10(SCL) U10.6(SCL) U11.6(SCL) U12.2(RX/SCL)
SC3: U1.11(SC3) U27.16(SCL) U30.26(SCL)
SC4: PAD13.1(P) U1.14(SC4)
SC5: R39.1 U1.16(SC5) U4.2(SCL)
SC6: U1.18(SC6)
SC7: U1.20(SC7)
SCL: R8.1 U1.22(SCL) U$2.P9.19(P9:I2C2_SCL)
SD0: IC2.2(SDA) R22.1 U1.4(SD0)
SD1: IC3.2(SDA) R30.1 U1.6(SD1)
SD2: TP2.TP TP6.TP TP38.TP TP42.TP U1.8(SD2) U9.9(SDA) U10.1(SDA) U11.1(SDA) U12.1(TX/SDA)
SD3: U1.10(SD3) U27.15(SDA) U30.27(SDA)
SD4: PAD12.1(P) U1.13(SD4)
SD5: R40.1 U1.15(SD5) U4.4(SDA)
SD6: U1.17(SD6)
SD7: U1.19(SD7)
SDA: R9.1 U1.23(SDA) U$2.P9.20(P9:I2C2_SDA)
T1: CH1-6.THERM CH1-7.THERM CH1-8.THERM CH1-9.THERM CH2-6.THERM CH2-7.THERM CH2-8.THERM CH2-9.THERM CH3-6.THERM CH3-7.THERM CH3-8.THERM CH3-9.THERM CH4-6.THERM CH4-7.THERM CH4-8.THERM CH4-9.THERM CH5-6.THERM CH5-7.THERM CH5-8.THERM CH5-9.THERM CH6-6.THERM CH6-7.THERM CH6-8.THERM CH6-9.THERM
USBM0: J2.USBM(8)(USBM)
USBM1: J3.USBM(8)(USBM)
USBP0: J2.USBP(7)(USBP)
USBP1: J3.USBP(7)(USBP)
Unconnected: IC2.3(EN) IC3.3(EN) U4.3(NC_2) U4.8(NC_3) U4.13(NC_4) U4.18(NC) U9.3(NINT) U12.5(PWM) U27.12(VOUT_D) U27.13(VOUT_B) U30.6(PWM0) U30.13(PWM7) U30.15(PWM8) U30.16(PWM9) U30.17(PWM10) U30.18(PWM11) U30.19(PWM12) U30.20(PWM13) U30.21(PWM14) U30.22(PWM15)

## Notes on the sheet
- Connectors
- Indicator LEDs
- Power Features
- 3.3V Indicator LED
- 24V Input Power Conditioning
- 5V Indicator LED
- 24V Indicator LED
- RJ45 and Buffer
  SD0 & SC0
- RJ45 and Buffer
  SD1 & SC1
- HTU20D(F) Temp / Humidity Sensor
- 5-26V to 3.3V@400mA Regulator 
  w/3v3 Enable, Indicator LED & Fuse
- CCS811 CO2 Sensor | T6713 CO2 Sensor
- 6 Channel 4 LED Series
- 3.3V@400mA Regulator
- Note:
  - I2C Addr = 0x5A if ADDR is LOW
  - I2C Addr = 0x5B if ADDR is HIGH
  - PWM & Sense must be connected together
  - Pull-up and decouple nReset to avoid erroneous
    noise-induced resets
- Note
  - I2C Address is 0x40
- SHT25 Temp / Humidity | 3.3V Enable Jumper | 3.3V Indicator LED
- Notes
  - See app note p.6 for i2c details
  - SDA has internal 4.7k pullup
  - SCL needs external 4.7k pullup
  - For I2C Comm, ground Ctrl/Test
  - I2C address default is 0x15
- Notes
  - I2C Address is 0x40
- 6-Channel 24V, 700mA (per channel) Current Regulator Module w/I2C Controlled Dimming via PWM or Analog Signaling
- Beaglebone Black Outline and throughholes
- 24V-0.7A Current Regulators
- I2C to 8-Channel 8-Bit DAC
- Notes:
  - GND !LDAC! for syncronous mode
  - Broadcast I2C Addr = 0x47
  - ADDR0=Low, I2C Addr=0x48
  - ADDR0=High, I2C Addr=0x4A
  - ADDR0=Float, I2C Addr=0x4C
- I2C Multiplexer
- I2C Address Select IO Ext 1
- I2C Pull-up Resistors
- PCA9685 16-Channel I2C PWM Driver
- I2C Address =
- 1 + A5 + A4 + A3 + A2 + A1 +A1 + RW
- Open = 0 / Closed = 1
- Original Board by Dan Poitrast
- Change Log:
- Released under the Creative Commons
  Attribution Share-Alike 4.0 License
  https://creativecommons.org/licenses/by-sa/4.0/

## Library data of the parts
ATTRIBUTES = openag-frames:DOCFIELD: DOCUMENT FIELD; AUTHOR: DP; DESCRIPTION: PFC EDU; TITLE: PFC EDU; URL: https://github.com/OpenAgInitiative/; VER: 1.0
C1 = openag-capacitors:4.7UF-C1206C475K5PACTU: Kemet - C1206C475K5PACTU - CAP CER 4.7UF 50V X5R 1206 Description: 4.7�F �10% 50V Ceramic Capacitor X5R 1206 (3216 Metric) Technical Specifications: Capacitance: 4.7uF Tolerance: ±10% Rated Voltage: 50V Temperature Coefficient: X5R Operating Temperature: -55°C ~ 85°C Package/Case: 1206 (3216 Metric) Datasheet(s): https://media.digikey.com/pdf/Data%20Sheets/Kemet%20PDFs/C1206C475K5PAC.pdf Vendor(s): Digikey: 399-5507-1-ND <https://www.digikey.com/product-detail/en/kemet/C1206C475K5PACTU/399-5507-1-ND/1950685>; POPULATE: YES; VERIFIED: NO
C2\2 C65 = openag-capacitors:4.7UF-CL21A475KBQNNNE: Samsung - CL21A475KBQNNNE - CAP CER 4.7UF 50V X5R 0805 Description: 4.7µF ±10% 50V Ceramic Capacitor X5R 0805 (2012 Metric) Technical Specifications: Capacitance: 4.7uF Tolerance: ±10% Rated Voltage: 50V Temperature Coefficient: X5R Operating Temperature: -55°C ~ 85°C Package/Case: 0805 (2012 Metric) Datasheet(s): CL21A475KBQNNNE Characteristics <http://www.samsungsem.com/kr/front/downloadcms.do?path=/kr/support/product-search/mlcc/__icsFiles/afieldfile/2014/11/05&fileName=C_CL21A475KBQNNNE.pdf> Vendor(s): Digikey: 1276-1248-1-ND <https://www.digikey.com/product-detail/en/samsung-electro-mechanics/CL21A475KBQNNNE/1276-1248-1-ND/3889334>; POPULATE: YES; VERIFIED: NO
C3 C5 C11 = rcl:C-US: CAPACITOR, American symbol
C9 = openag-capacitors:10UF-CL31B106KBHNNNE: Samsung - CL31B106KBHNNNE - CAP CER 10UF 50V X7R 1206 Description: 10�F �10% 50V Ceramic Capacitor X7R 1206 (3216 Metric) Technical Specifications: Capacitance: 10uF Tolerance: ±10% Rated Voltage: 50V Temperature Coefficient: X7R Operating Temperature: -55°C ~ -125°C Package/Case: 1206 (3216 Metric) Datasheet(s): CL Series, MLCC Datasheet <https://media.digikey.com/pdf/Data%20Sheets/Samsung%20PDFs/CL_Series_MLCC_ds.pdf> Vendor(s): Digikey: 1276-6767-1-ND <https://www.digikey.com/product-detail/en/samsung-electro-mechanics-america-inc/CL31B106KBHNNNE/1276-6767-1-ND/5961626>; POPULATE: YES; VERIFIED: NO
C13-C16 C21 C64 = openag-capacitors:0.1UF-C0603C104K5RACTU: Kemet - C0603C104K5RACTU - CAP CER 0.1UF 50V X7R 0603 Description: 0.1µF ±10% 50V Ceramic Capacitor X7R 0603 (1608 Metric) Technical Specifications: Capacitance: 0.1µF Tolerance: ±10% Rated Voltage: 50V Temperature Coefficient: X7R Operating Temperature: -55°C ~ 125°C Package / Case: 0603 (1608 Metric) Datasheet(s): X7R Dielectric, 6.3-250 VDC <https://search.kemet.com/component-edge/download/datasheet/C0603C104K5RACTU.pdf> Vendor(s): Digikey: 399-5089-1-ND <https://www.digikey.com/product-detail/en/kemet/C0603C104K5RACTU/399-5089-1-ND/1465623>; POPULATE: YES; VERIFIED: NO
C22 C71 = openag-capacitors:10UF-GMK212BBJ106KG-T: Taiyo Yuden - GMK212BBJ106KG-T - CAP CER 10UF 35V X5R 0805 Description: 10µF ±10% 35V Ceramic Capacitor X5R 0805 (2012 Metric) Technical Specifications: Capacitance: 10µF Tolerance: ±10% Rated Voltage: 35V Temperature Coefficient: X5R Operating Temperature: -55°C ~ 85°C Package / Case: 0805 (2012 Metric) Datasheet(s): GMK212BBJ106KG-T Spec <http://ds.yuden.co.jp/TYCOMPAS/ut/detail.do?productNo=GMK212BBJ106KG-T&fileName=GMK212BBJ106KG-T_SS&mode=specSheetDownload> Vendor(s): Digikey: 587-4893-1-ND <https://www.digikey.com/product-detail/en/taiyo-yuden/GMK212BBJ106KG-T/587-4893-1-ND/6563736>; POPULATE: YES; VERIFIED: NO
C44 C45 C47 C48 C50 C51 C53 C54 C56 C57 C59 C60 = openag-capacitors:10NF-C0603C103K5RACTU: KEMET - C0603C103K5RACTU - CAP CER 10000PF 50V X7R 0603 Description: 10000pF ±10% 50V Ceramic Capacitor X7R 0603 (1608 Metric) Technical Specifications: Capacitance: 10000pF Tolerance: ±10% Voltage - Rated: 50V Temperature Coefficient: X7R Operating Temperature: -55°C ~ 125°C Applications: General Purpose Mounting Type: Surface Mount, MLCC Package / Case: 0603 (1608 Metric) Size / Dimension: 0.063" L x 0.032" W (1.60mm x 0.80mm) Thickness (Max): 0.034" (0.87mm) Datasheet(s): X7R Dielectric, 6.3-250 VDC <https://search.kemet.com/component-edge/download/datasheet/C0603C103K5RACTU.pdf> Vendor(s): Digikey: 399-1091-1-ND <https://www.digikey.com/product-detail/en/kemet/C0603C103K5RACTU/399-1091-1-ND/411366#>; POPULATE: YES; VERIFIED: NO
C46 C49 C52 C55 C58 C61 = openag-capacitors:100UF-EEE-1HA101UP: Panasonic - EEE-1HA101UP - ELECTROLYTIC CAP ALUM 100UF 20% 50V SMD Description: 100µF 50V Aluminum Electrolytic Capacitors Radial, Can - SMD 2000 Hrs @ 85°C Technical Specifications: Capacitance: 100uF Tolerance: ±20% Rated Voltage: 50V Polarization: Polar Operating Temperature: -40°C ~ 85°C Datasheet(s): S Series, Type V <https://industrial.panasonic.com/cdbs/www-data/pdf/RDE0000/ABA0000C1145.pdf> Vendor(s): Digikey: PCE3917CT-ND <https://www.digikey.com/product-detail/en/panasonic-electronic-components/EEE-1HA101UP/PCE3917CT-ND/766293>; POPULATE: YES; VERIFIED: NO
CH1+1 CH1-1 CH2+1 CH2-1 CH3+1 CH3-1 CH4+1 CH4-1 CH5+1 CH5-1 CH6+1 CH6-1 = openag-wirepads:3,17/1,3: THROUGH-HOLE PAD
CH1-6-CH1-9 CH2-6-CH2-9 CH3-6-CH3-9 CH4-6-CH4-9 CH5-6-CH5-9 CH6-6-CH6-9 = Tomaszewski:LED_W/THERM
D1 = openag-diodes:SMAJ14A: TVS DIODE 14VWM 23.2VC SMA - Littlefuse - SMAJ14A - SMAJ14ALFCT-ND Description: The SMAJ series is designed specifically to protect sensitive electronic equipment from voltage transients induced by lightning and other transient voltage events Technical Specifications: Type: Zener Voltage - Reverse Standoff (Typ): 14V Voltage - Breakdown (Min): 15.6V Voltage - Clamping (Max) @ Ipp: 23.2V Current - Peak Pulse (10/1000�s): 17.2A Operating Temperature: -55�C ~ 150�C (TJ) Mounting Type: Surface Mount Package / Case: DO-214AC, SMA Datasheet(s): SMAJ Series <http://www.littelfuse.com/~/media/electronics/datasheets/tvs_diodes/littelfuse_tvs_diode_smaj_datasheet.pdf.pdf> Vendor(s): Digikey: SMAJ14ALFCT-ND <https://www.digikey.com/product-detail/en/littelfuse-inc/SMAJ14A/SMAJ14ALFCT-ND/762486>; POPULATE: YES; VERIFIED: NO
D2-D4 D8 = openag-diodes:APT1608CGCK: Kingbright - APT1608CGCK - LED GREEN CLEAR 0603 SMD Description: Green 570nm LED Indication - Discrete 2.1V 0603 (1608 Metric) Technical Specifications: Color: Green Lens Color: Colorless Lens Transparency: Clear Millicandela Rating: 50mcd Lens Style/Size: Rectangle with Flat Top, 1.20mm x 0.80mm Voltage - Forward (Vf) (Typ): 2.1V Current - Test: 20mA Viewing Angle: 120° Mounting Type: Surface Mount Wavelength - Dominant: 570nm Wavelength - Peak: 574nm Package / Case: 0603 (1608 Metric) Supplier Device Package: Chip LED Size / Dimension: 1.60mm L x 0.80mm W Height (Max): 0.75mm Datasheet(s): APT1608CGCK <http://www.kingbrightusa.com/images/catalog/SPEC/APT1608CGCK.pdf> Vendor(s): Digikey: 754-1116-1-ND <https://www.digikey.com/product-detail/en/kingbright/APT1608CGCK/754-1116-1-ND/1747833#>; POPULATE: YES; VERIFIED: NO
F1 = openag-fuses:0438.375WR: Littelfuse Inc. - 0448.400MR - FUSE BOARD MNT 400MA 125VAC/VDC Description: FUSE BOARD MNT 400MA 125VAC/VDC Technical Specifications: Fuse Type: Board Mount (Cartridge Style Excluded) Current Rating: 400mA Voltage Rating - AC: 125V Voltage Rating - DC: 125V Response Time: Fast Package / Case: 2-SMD, Square End Block Mounting Type: Surface Mount Breaking Capacity @ Rated Voltage: 50A Melting I²t: 0.0416 Approvals: CSA, UL Operating Temperature: -55°C ~ 125°C Size / Dimension: 0.240" L x 0.106" W x 0.106" H (6.10mm x 2.69mm x 2.69mm) DC Cold Resistance: 0.4895 Ohms Datasheet(s): 448 Series Datasheet <http://www.littelfuse.com/~/media/electronics/datasheets/fuses/littelfuse_fuse_448_datasheet.pdf.pdf> Vendor(s): Digikey: F5573CT-ND <https://www.digikey.com/product-detail/en/littelfuse-inc/0448.400MR/F5573CT-ND/3306934>; POPULATE: YES; VERIFIED: YES
F11 = openag-fuses:SST_7: Bel Fuse - SST7 - FUSE BRD MNT 7A 125VAC/VDC 2SMD Description: FUSE BRD MNT 7A 125VAC/VDC 2SMD Technical Specifications: Current Rating: 7A Voltage Rating: 125V Fuse Type: Board Mount (Cartridge Style Excluded) Mounting Type: Surface Mount Operating Temperature: -55°C ~ 125°C Datasheet(s): SST Type <https://belfuse.com/resources/StewartConnector/SST.pdf> Vendor(s): Digikey: 507-1072-1-ND <https://www.digikey.com/product-detail/en/bel-fuse-inc/SST-7/507-1072-1-ND/615026>; POPULATE: YES; VERIFIED: NO
F12 = fuse:GSH15: FUSE HOLDER grid 15mm, 19649 Wickmann; MPN: 64900001039; OC_FARNELL: 1271673; OC_NEWARK: 02P0318
IC2 IC3 = PCA9615DP:PCA9615DP: Buffer, ReDriver 2 Channel 400kHz 10-TSSOP Source: Datasheet <http://www.nxp.com/docs/en/data-sheet/PCA9615.pdf>; DESCRIPTION: Buffer, ReDriver 2 Channel 400kHz 10-TSSOP; HEIGHT: 1.1mm; MANUFACTURER_NAME: Nexperia; MANUFACTURER_PART_NUMBER: PCA9615DP; SUPPLIER_NAME: RS
J2 J3 = openag_connector:OPENAG-V1-RJ45: Amphenol FCI - 54602-908LF - CONN MOD JACK 8P8C R/A UNSHLD Description: Jack Modular Connector 8p8c (RJ45, Ethernet) 90� Angle (Right) Unshielded Cat3 Technical Specifications: Connector Type: Jack Number of Positions/Contacts: 8p8c (RJ45, Ethernet) Number of Ports: 1 Number of Rows: 1 Mounting Type: Through Hole Orientation: 90� Angle (Right) Termination: Solder Shielding: Unshielded Ratings: Cat3 Features: Board Lock LED Color: Does Not Contain LED Tab Direction: Down Contact Material: Copper Alloy Contact Finish: Gold Contact Finish Thickness: 15�in (0.38�m) Housing Material: Polyester, Glass Filled Operating Temperature: -40�C ~ 70�C Datasheet(s): 54601-x04(zzz)WPLF Drawing <http://cdn.amphenol-icc.com/media/wysiwyg/files/drawing/c-bmj-0102.pdf> Vendor(s): Digikey: 609-1046-ND <https://www.digikey.com/product-detail/en/amphenol-fci/54602-908LF/609-1046-ND/1001360>; POPULATE: YES; VERIFIED: NO
L7 L9-L13 = openag-inductors:120UH-74404064121: Wurth Electronics - 74404064121 - FIXED IND 120UH 790MA 520 MOHM Technical Specifications: Inductance: 120uH Rated Current: 790mA Saturation Current: 980mA DC Resistance: 520mΩ Operating Temperature: -40° C to 125°C Datasheet(s): 74404064121 Drawing <http://katalog.we-online.de/pbs/datasheet/74404064121.pdf> Vendors: Digikey: 732-7258-1-ND <https://www.digikey.com/product-detail/en/wurth-electronics-inc/74404064121/732-7258-1-ND/5353238>; POPULATE: YES; VERIFIED: NO
PAD1-PAD10 = wirepad:WIREPAD: Wire PAD connect wire on PCB
PAD11-PAD14 = wirepad:SMD2: SMD PAD
Q1-Q3 = transistor-npn:BCF30*: NPN Transistor
R1 R13 R16-R31 R34-R36 R38 R41 = rcl:R-US_: RESISTOR, American symbol
R2-R9 R14 R15 R32 R33 R37 R39 R40 = SparkFun-Resistors:10KOHM-1/10W-1%(0603): RES-00824; PROD_ID: RES-00824
R10-R12 R44 = openag-resistors:100OHM-RC0603JR-07100RL: Yageo - RC0603JR-07100RL - RES SMD 100 OHM 5% 1/10W 0603 Description: 100 Ohms ±5% 0.1W, 1/10W Chip Resistor 0603 (1608 Metric) Moisture Resistant Thick Film Technical Specifications: Resistance: 100 Ohms Tolerance: ±5% Power (Watts): 0.1W, 1/10W Composition: Thick Film Features: Moisture Resistant Temperature Coefficient: ±100ppm/°C Operating Temperature: -55°C ~ 155°C Package / Case: 0603 (1608 Metric) Supplier Device Package: 0603 Size / Dimension: 0.063" L x 0.032" W (1.60mm x 0.80mm) Height - Seated (Max): 0.022" (0.55mm) Number of Terminations: 2 Datasheet(s): Thick Film Chip Resistor Intro <http://www.yageo.com.tw/exep/pages/download/literatures/PYu-R_INT-thick_7.pdf> Chip Resistor Marking <http://www.yageo.com/exep/pages/download/literatures/PYu-R_Marking_2.pdf> RC Series, L Datasheet <http://www.yageo.com/documents/recent/PYu-RC_Group_51_RoHS_L_8.pdf> Vendor(s): Digikey: 311-100GRCT-ND <https://www.digikey.com/product-detail/en/yageo/RC0603JR-07100RL/311-100GRCT-ND/729644>; POPULATE: YES; VERIFIED: NO
R42 = openag-resistors:4.7K-RC1206JR-074K7L: Yageo - RC1206JR-074K7L - RES SMD 4.7K OHM 5% 1/4W 1206 Description: 4.7 kOhms ±5% 0.25W, 1/4W Chip Resistor 1206 (3216 Metric) Moisture Resistant Thick Film Technical Specifications: Resistance: 4.7 kOhms Tolerance: ±5% Power (Watts): 0.25W, 1/4W Composition: Thick Film Features: Moisture Resistant Temperature Coefficient: ±100ppm/°C Operating Temperature: -55°C ~ 155°C Package / Case: 1206 (3216 Metric) Supplier Device Package: 1206 Size / Dimension: 0.122" L x 0.063" W (3.10mm x 1.60mm) Height - Seated (Max): 0.026" (0.65mm) Number of Terminations: 2 Datasheet(s): Thick Film Chip Resistor Intro <http://www.yageo.com.tw/exep/pages/download/literatures/PYu-R_INT-thick_7.pdf> Chip Resistor Marking <http://www.yageo.com/exep/pages/download/literatures/PYu-R_Marking_2.pdf> RC Series, L Datasheet <http://www.yageo.com/documents/recent/PYu-RC_Group_51_RoHS_L_8.pdf> Vendor(s): Digikey: 311-4.7KERCT-ND <https://www.digikey.com/product-detail/en/yageo/RC1206JR-074K7L/311-4.7KERCT-ND/732242>; POPULATE: YES; VERIFIED: NO
R94-R99 R109 = openag-resistors:1K-ERJ-PB3D1001V: Panasonic - P20283CT-ND - RES SMD 1K OHM 0.5% 1/5W 0603 Description: 1 kOhms ±0.5% 0.2W, 1/5W Chip Resistor 0603 (1608 Metric) Automotive AEC-Q200, Pulse Withstanding Thick Film Technical Specifications: Resistance: 1 kOhms Tolerance: ±0.5% Power: 0.2W, 1/5W Operating Temperature: -55°C ~ 155°C Package / Case: 0603 (1608 Metric) Datasheet(s): ERJ-PB3, PB6 Series, High Precision Datasheet <https://industrial.panasonic.com/cdbs/www-data/pdf/RDM0000/AOA0000C328.pdf> Vendor(s): Digikey: P20283CT-ND <https://www.digikey.com/product-detail/en/panasonic-electronic-components/ERJ-PB3D1001V/P20283CT-ND/6214538>; POPULATE: YES; VERIFIED: NO
R100-R106 = openag-resistors:10K-ERJ-3EKF1002V: Panasonic - ERJ-3EKF1002V - RES SMD 10K OHM 1% 1/10W 0603 Description: 10 kOhms ±1% 0.1W, 1/10W Chip Resistor 0603 (1608 Metric) Automotive AEC-Q200 Thick Film Technical Specifications: Resistance: 10kOhms Tolerance: ±1% Power: 0.1W, 1/10W Operating Temperature: -55°C ~ 155°C Package/Case: 0603 (1608 Metric) Datasheet(s): ERJ-3EKF1002V View All Specifications <https://industrial.panasonic.com/ww/products/resistors/chip-resistors/general-purpose-chip-resistors/precision-thick-film-chip-resistors/ERJ3EKF1002V> Vendor(s): Digikey: P10.0KHCT-ND <https://www.digikey.com/product-detail/en/panasonic-electronic-components/ERJ-3EKF1002V/P10.0KHCT-ND/198102>; POPULATE: YES; VERIFIED: NO
R110 = openag-resistors:0OHM-RC0603JR-070RL: Yageo - RC0603JR-070RL - RES SMD 0 OHM JUMPER 1/10W 0603 Description: 0 Ohms Jumper 0.1W, 1/10W Chip Resistor 0603 (1608 Metric) Moisture Resistant Thick Film Technical Specifications: Resistance: 0 Ohms Power: 0.1W, 1/10W Operating Temperature: -55°C ~ 155°C Package / Case: 0603 (1608 Metric) Datasheet(s): RC Series, L Datasheet <http://www.yageo.com/documents/recent/PYu-RC_Group_51_RoHS_L_8.pdf> Vendor(s): Digikey: 311-0.0GRCT-ND <https://www.digikey.com/product-detail/en/yageo/RC0603JR-070RL/311-0.0GRCT-ND/729622>; POPULATE: YES; VERIFIED: NO
SJ1 SJ_A18-SJ_A29 SJ_A34 SJ_A35 = openag-connectors:SOLDERJUMPER: SMD Solder JUMPER Solder the two pads together to create a connection, or remove the solder to break it. REFLOW - Use this footprint for solder paste and reflow ovens. WAVE - Use this footprint for hand-soldering (larger pads). CLOSED - Has a trace between the two pads to ensure it is closed by default. The trace needs to be cut to disable the jumper, and can be closed again by creating a solder bridge between the two pads.; POPULATE: YES; VERIFIED: NO
T1 T2 = R-78E5.0-1.0:R-78E5.0-1.0: Non-Isolated DC/DC Converters 8-28Vin 5V 1.0A THRU <https://componentsearchengine.com/Images/1/R-78E5.0-1.0.jpg> Source: Datasheet <http://www.recom-power.com/pdf/Innoline/R-78Exx-1.0.pdf>; DESCRIPTION: Non-Isolated DC/DC Converters 8-28Vin 5V 1.0A THRU; HEIGHT: mm; MANUFACTURER_NAME: RECOM Power; MANUFACTURER_PART_NUMBER: R-78E5.0-1.0; RS_PART_NUMBER: 1446290; SUPPLIER_NAME: RS
TP1-TP3 TP5-TP7 TP36-TP45 TP61-TP63 = openag-testpads:TP: Test pad
U1 = OpenAG_I2C:TCA9548APWR; MANUFACTURER_PART_NUMBER: TCA9548APWR; VENDOR: TEXAS INSTRUMENTS
U2 U3 U5 = OpenAG_I2C:STD12NF06LT4; MANUFACTURER_PART_NUMBER: STD12NF06LT4; VENDOR: ST Microelectronics
U4 = IO_Expander:PCF8574APWR; MANUFACTURER_PART_NUMBER: PCF8574APWR; VENDOR: Texas Instruments
U9 = openag-sensors:CCS811: ams - CCS811 - LOW POWER DIGITAL SENSOR FOR IND Description: Air Quality Sensor I²C Technical Specifications: Type: Air Quality Output: I²C Operating Temperature: -5°C ~ 50°C Voltage - Supply: 1.8 V ~ 3.6 V Current - Supply: 26mA Datasheet(s): CCS811 Datasheet <http://ams.com/eng/content/download/951091/2269479/471718> CCS811 Factsheet <http://ams.com/eng/content/view/download/490399> Vendor(s): Digikey: CCS811CT-ND <https://www.digikey.com/product-detail/en/ams/CCS811/CCS811CT-ND/6569300>; POPULATE: YES; VERIFIED: NO
U10 = openag-sensors:HPP845E034R5: TE Connectivity Measurement Specialties - HPP845E034R5 - SENSOR HUMID/TEMP 3V I2C 3% SMD Description: Humidity Temperature Sensor 0 ~ 100% RH I²C ±5% RH 5s Surface Mount Technical Specifications: Sensor Type: Humidity, Temperature Humidity Range: 0 ~ 100% RH Output Type: I²C Output: 12b Accuracy: ±5% RH Response Time: 5s Voltage - Supply: 1.5 V ~ 3.6 V Mounting Type: Surface Mount Operating Temperature: -40°C ~ 125°C Datasheet(s): HTU20D(F) Series (HPP845E034Rx) Datasheet <http://www.te.com/commerce/DocumentDelivery/DDEController?Action=srchrtrv&DocNm=HPC202_5&DocType=Data+Sheet&DocLang=English> Vendor(s): Digikey: 223-1592-1-ND <https://www.digikey.com/product-detail/en/te-connectivity-measurement-specialties/HPP845E034R5/223-1592-1-ND/5416096>; POPULATE: YES; VERIFIED: NO
U11 = openag-sensors:SHT25: Sensirion AG - SHT25 - SENSOR HUMI/TEMP 3V I2C 1.8% SMD Description: Humidity Temperature Sensor 0 ~ 100% RH I²C ±1.8% RH 8s Surface Mount Technical Specifications: Sensor Type: Humidity, Temperature Humidity Range: 0 ~ 100% RH Output Type: I²C Output: 12b Accuracy: ±1.8% RH Response Time: 8s Voltage - Supply: 2.1 V ~ 3.6 V Mounting Type: Surface Mount Operating Temperature: -40°C ~ 125°C Datasheet(s): SHTxx Testing Guide <https://www.sensirion.com/fileadmin/user_upload/customers/sensirion/Dokumente/2_Humidity_Sensors/Sensirion_Humidity_Sensors_Testing_Guide_V1.2.pdf> SHTxx Handling Instructions <https://www.sensirion.com/fileadmin/user_upload/customers/sensirion/Dokumente/2_Humidity_Sensors/Sensirion_Humidity_Sensors_Handling_Instructions_V4.pdf> Sensor Specification Statement <https://www.sensirion.com/fileadmin/user_upload/customers/sensirion/Dokumente/2_Humidity_Sensors/Sensirion_Humidity_Sensors_Specification_Statement_V1.pdf> SHTxx, STSxx Assembly SMD Pkgs <https://www.sensirion.com/fileadmin/user_upload/customers/sensirion/Dokumente/2_Humidity_Sensors/Sensirion_Humidity_Sensors_Handling_of_SMD_Packages_V1.pdf> SHT25 Datasheet <https://www.sensirion.com/fileadmin/user_upload/customers/sensirion/Dokumente/2_Humidity_Sensors/Sensirion_Humidity_Sensors_SHT25_Datasheet_V3.pdf> Vendor(s): Digikey: 1649-1008-1-ND <https://www.digikey.com/product-detail/en/sensirion-ag/SHT25/1649-1008-1-ND/5872290>; POPULATE: YES; VERIFIED: NO
U12 = openag-sensors:T6713-5K: Amphenol Advanced Sensors - T6713-5K - CO2 MODULE 5000PPM DIFFUSION Description: CO2 Sensor I²C Technical Specifications: Type: CO2 Accuracy: ±2% Output: I²C Operating Temperature: 14 ~ 140°F (-10 ~ 60°C) Voltage - Supply: 4.5 V ~ 5.5 V Current - Supply: 200mA Datasheet(s): T6713 Series Datasheet <http://www.amphenol-sensors.com/en/component/edocman/297-telaire-t6713-series-datasheet/download?Itemid=591> Telaire CO2 Module Selection Guide <http://www.amphenol-sensors.com/en/component/edocman/488-telaire-co2-module-selection-guide-single-or-dual-channel/download?Itemid=591> T67xx Appl Note <http://www.amphenol-sensors.com/en/component/edocman/332-telaire-6700-series-application-note/download?Itemid=591> Vendor(s): Digikey: 235-1374-ND <https://www.digikey.com/products/en?keywords=235-1374>; POPULATE: YES; VERIFIED: NO
U17 = openag-regulators:LM2937IMP-3.3/NOPB: Texas Instruments - LM2937IMP-3.3/NOPB - IC REG LIN 3.3V 400MA SOT223-4 Description: Linear Voltage Regulator IC Positive Fixed 1 Output 3.3V 400mA SOT-223-4 Technical Specifications: Output Configuration: Positive Output Type: Fixed Number of Regulators: 1 Voltage - Input (Max): 26V Voltage - Output (Min/Fixed): 3.3V Voltage Dropout (Max): 1V @ 50mA Current - Output: 400mA Current - Quiescent (Iq): 2mA Current - Supply (Max): 1.25A Protection Features: Over Temperature, Reverse Polarity, Short Circuit Operating Temperature: -40°C ~ 85°C Mounting Type: Surface Mount Package / Case: TO-261-4, TO-261AA Supplier Device Package: SOT-223-4 Base Part Number: LM2937 Datasheet(s): LM2937-2.5, LM2937-3.3 Datasheet <http://www.ti.com/lit/ds/symlink/lm2937-2.5.pdf> Vendor(s): Digikey: LM2937IMP-3.3/NOPBCT-ND <https://www.digikey.com/product-detail/en/texas-instruments/LM2937IMP-3.3-NOPB/LM2937IMP-3.3-NOPBCT-ND/270742#>; POPULATE: YES; VERIFIED: NO
U20-U25 = openag-regulators:RCD-24-0.70/VREF: Recom Power - RCD-24-0.70/VREF - LED SUPPLY CC BUCK 2-35V 700MA Description: 700mA 2 ~ 35 V Constant Current LED Driver Buck Topology 1 Output Technical Specifications: Type: Constant Current Topology: Buck Number of Outputs: 1 Voltage - Input (Min): 4.5V Voltage - Input (Max): 36V Voltage - Output: 2 ~ 35 V Current - Output (Max): 700mA Power (Watts): 25W Dimming: Analog Features: SCP Operating Temperature: -40°C ~ 71°C Efficiency: 96% Mounting Type: Through Hole Package / Case: 6-DIP Module Size / Dimension: 0.87" L x 0.49" W x 0.33" H (22.1mm x 12.6mm x 8.5mm) Approvals: cULus Weight: 0.01 lb (4.54g) Datasheet(s): RCD-24 Series Datasheet <https://www.recom-power.com/pdf/Lightline/RCD-24.pdf> Vendor(s): Digikey: 945-1806-5-ND <https://www.digikey.com/product-detail/en/recom-power/RCD-24-0.70-VREF/945-1806-5-ND/2613767>; POPULATE: YES; VERIFIED: NO
U27 = openag-dacs:DAC5578SPW: Texas Instruments - DAC5578SPW Description: 8 Bit Digital to Analog Converter 8 16-TSSOP Technical Specifications: Number of Bits: 8-bit Number of D/A Converters: 8 Settling Time: 12us Operating Voltage: 2.7V - 5.5V Operating Temperature: -40° C to 125°C Max IDD (Normal Mode): 1.4mA Output Short Circuit Current (Individual): 25mA Datasheet(s): DAC5578,6578,7578 <http://www.ti.com/lit/ds/symlink/dac5578.pdf> Vendor(s): Digikey: 296-27736-5-ND <https://www.digikey.com/product-detail/en/texas-instruments/DAC5578SPW/296-27736-5-ND/2360827>; POPULATE: YES; VERIFIED: NO
U30 = openag-pwm:PCA9685PW/Q900,118: NXP USA Inc. - PCA9685PW/Q900,118 - IC LED DRVR LIN DIM 25MA 28TSSOP Description: LED Driver IC 16 Output Linear PWM Dimming 25mA 28-TSSOP Technical Specifications: Type: Linear Internal Switch(s): Yes Number of Outputs: 16 Voltage - Supply (Min): 2.3V Voltage - Supply (Max): 5.5V Voltage - Output: 5.5V Current - Output / Channel: 25mA Dimming: PWM Applications: Backlight Operating Temperature: -40°C ~ 85°C (TA) Mounting Type: Surface Mount Package / Case: 28-TSSOP (0.173", 4.40mm Width) Supplier Device Package: 28-TSSOP Base Part Number: PCA9685 Datasheet(s): LED Controllers Leaflet <http://www.nxp.com/documents/leaflet/75016950.pdf> PCA9685 <https://www.nxp.com/docs/en/data-sheet/PCA9685.pdf> Vendor(s): Digikey: 568-5931-1-ND <https://www.digikey.com/product-detail/en/nxp-usa-inc/PCA9685PW-Q900118/568-5931-1-ND/2531218>
U$1 U$3 = PJ-036ah:PJ-036AH
U$2 = SparkFun-Boards:BEAGLE_BONE_BLACK_CAPE